# EAGLE board beaglebone_basic_v1.12 (EAGLE 5.11), part 1 of 3
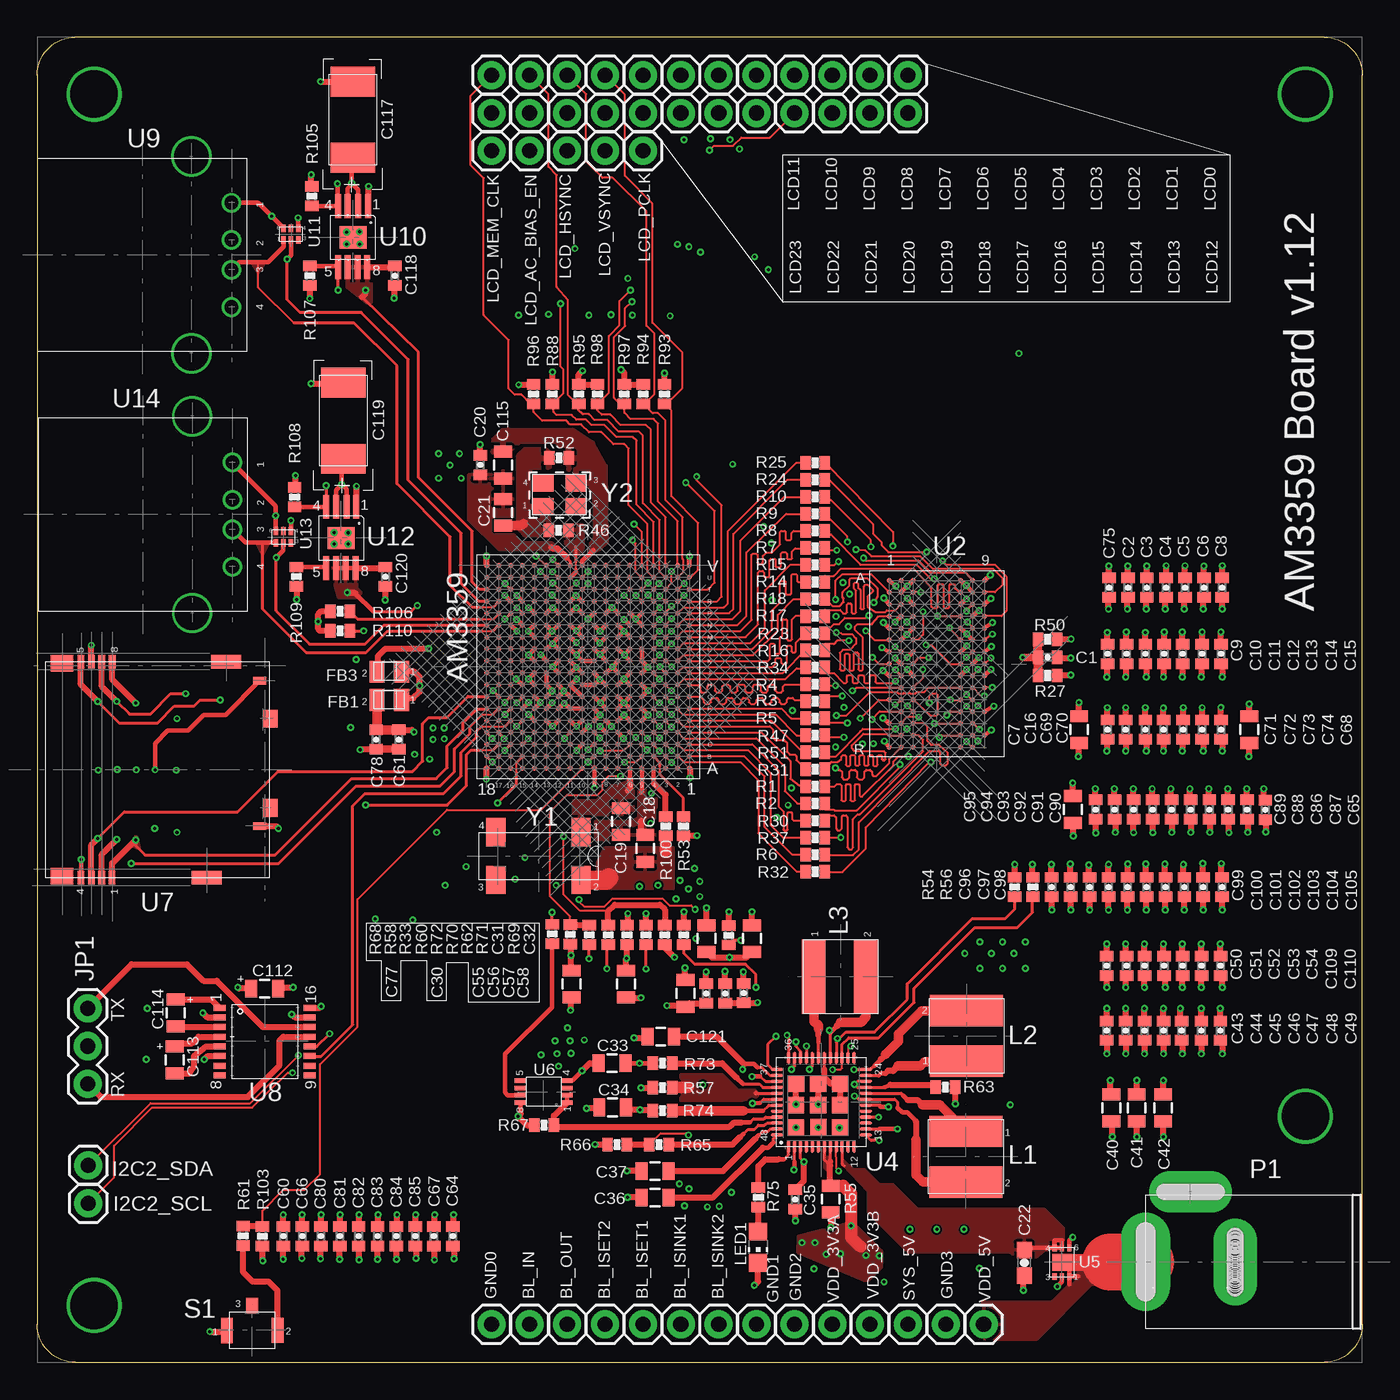
[diagram p7: board, top side]
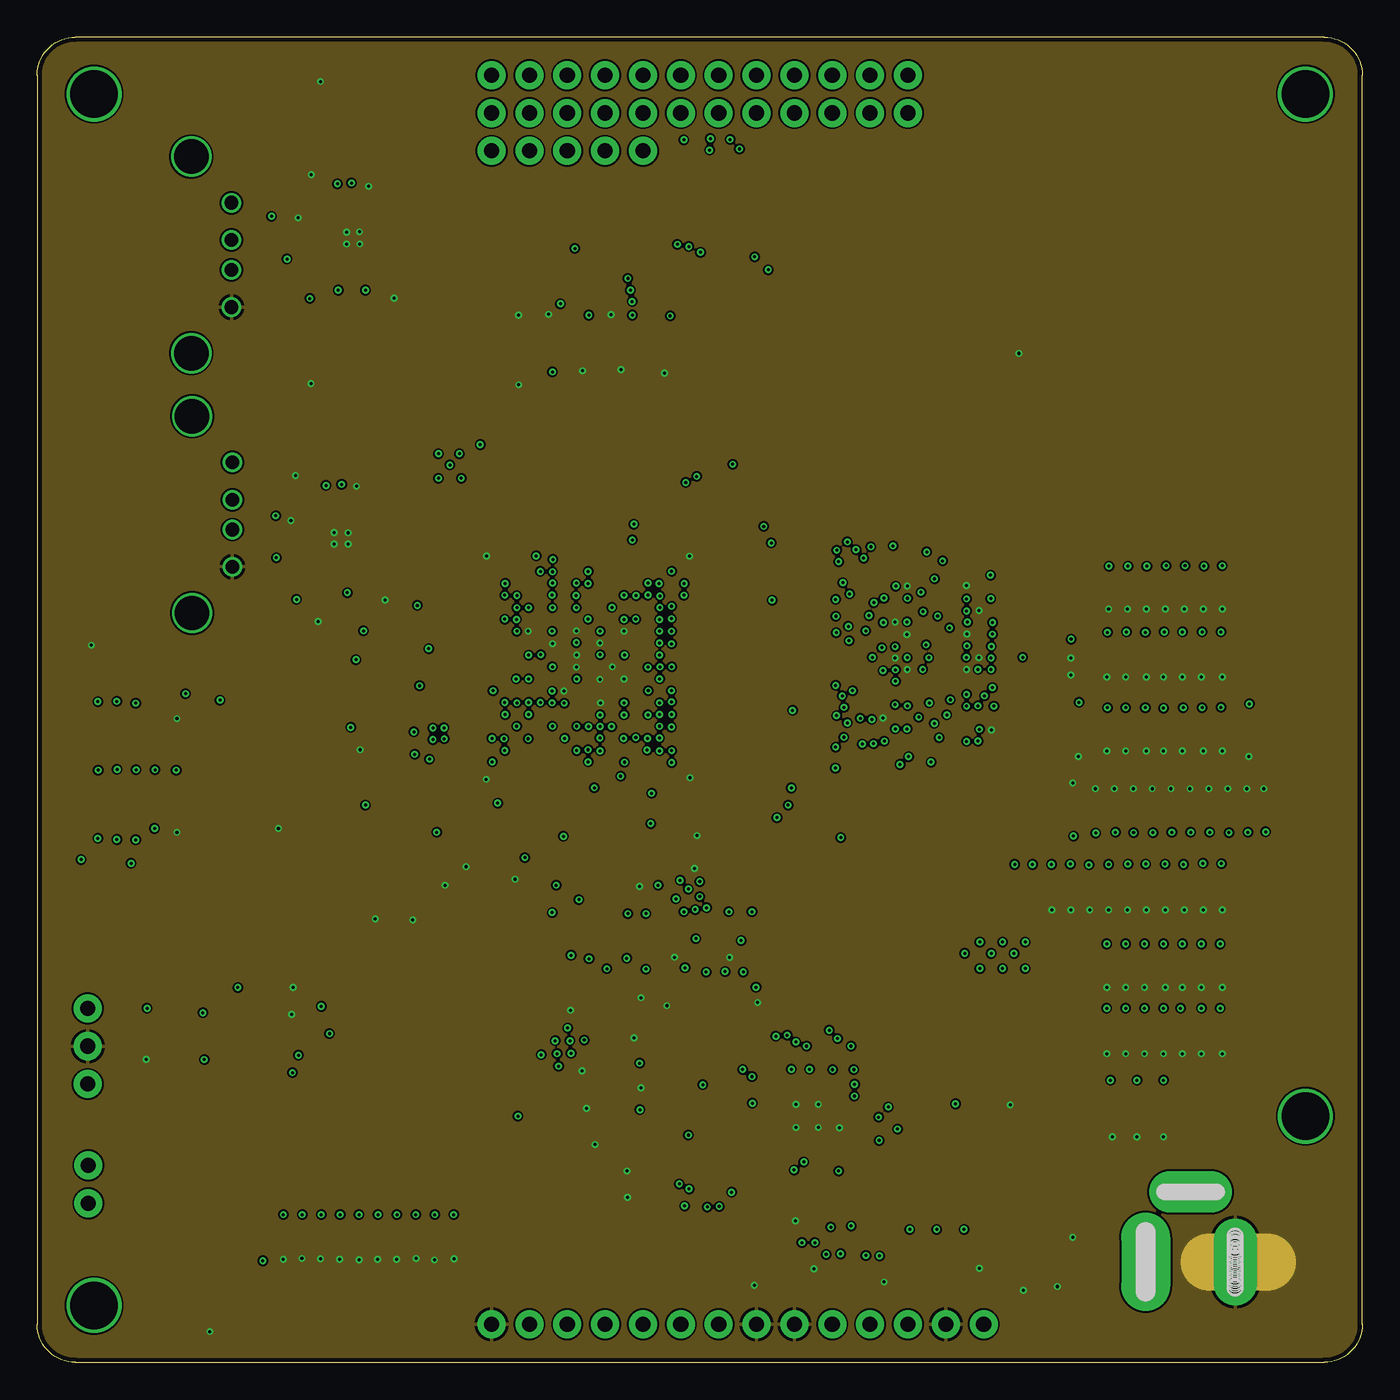
[diagram p8: board, inner layer Route2]
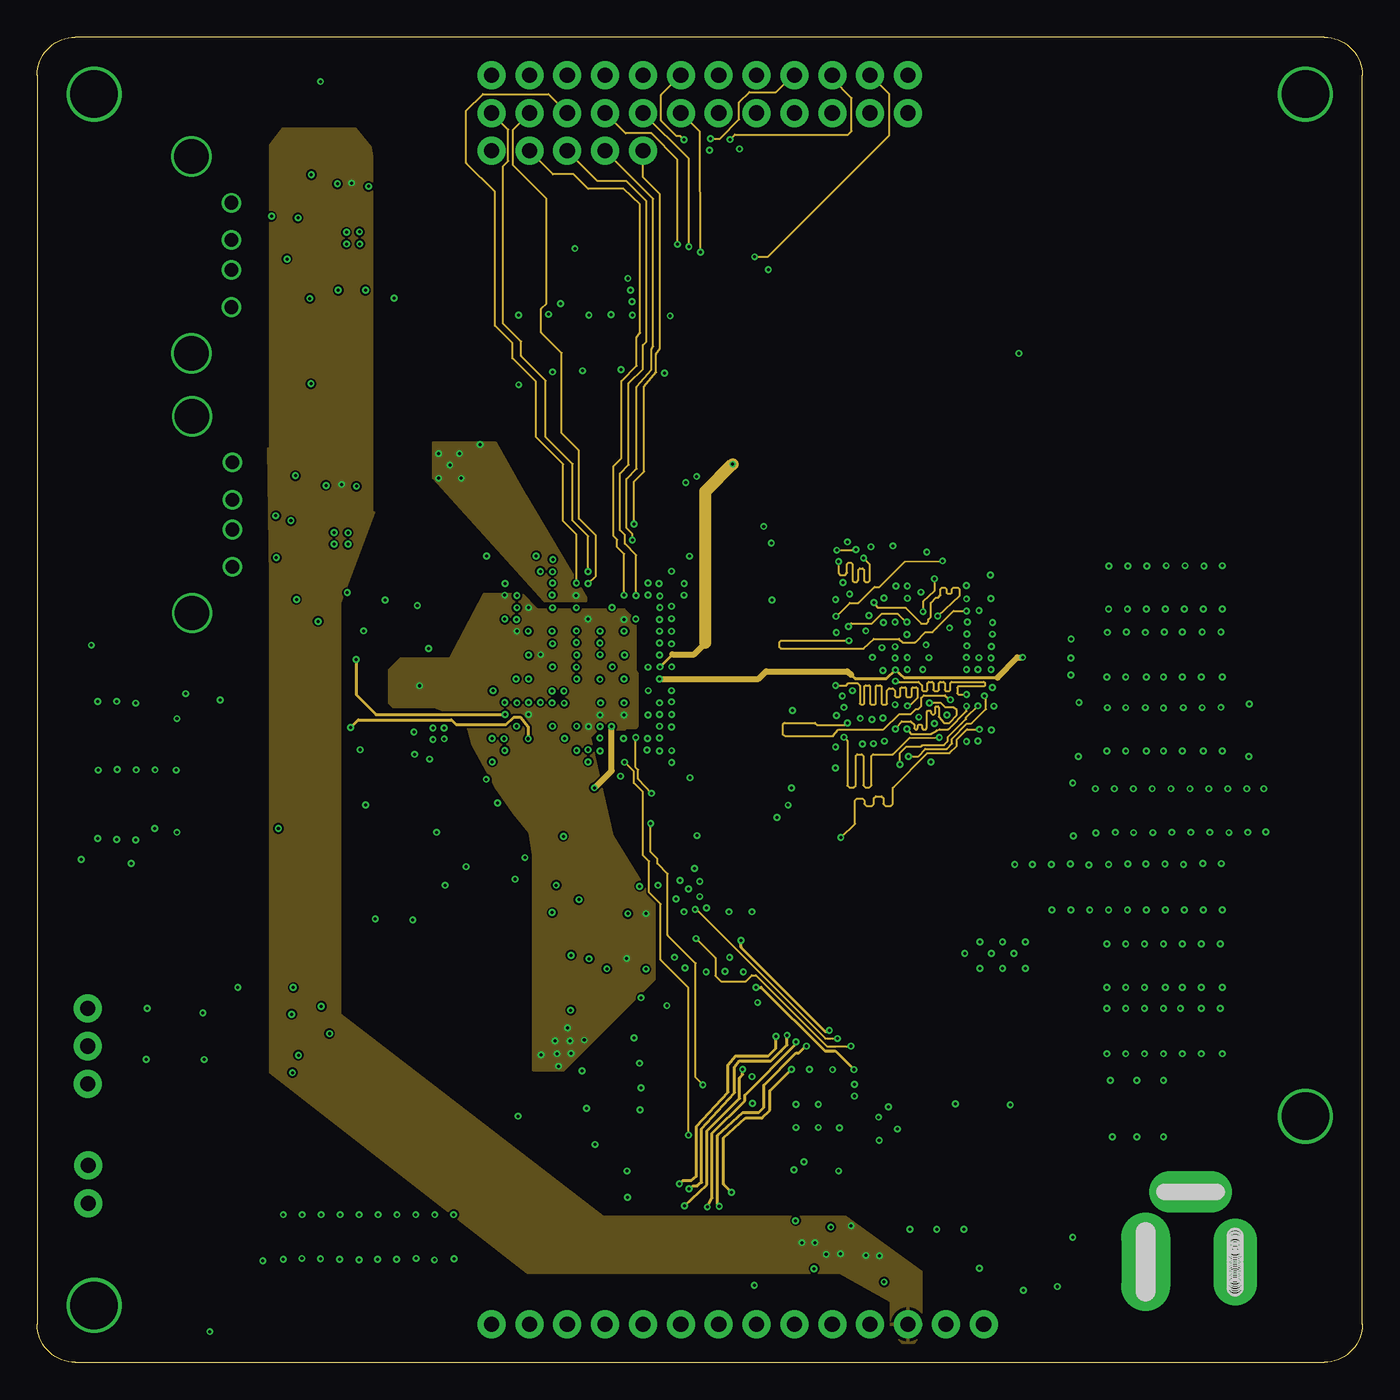
[diagram p9: board, inner layer Route3]
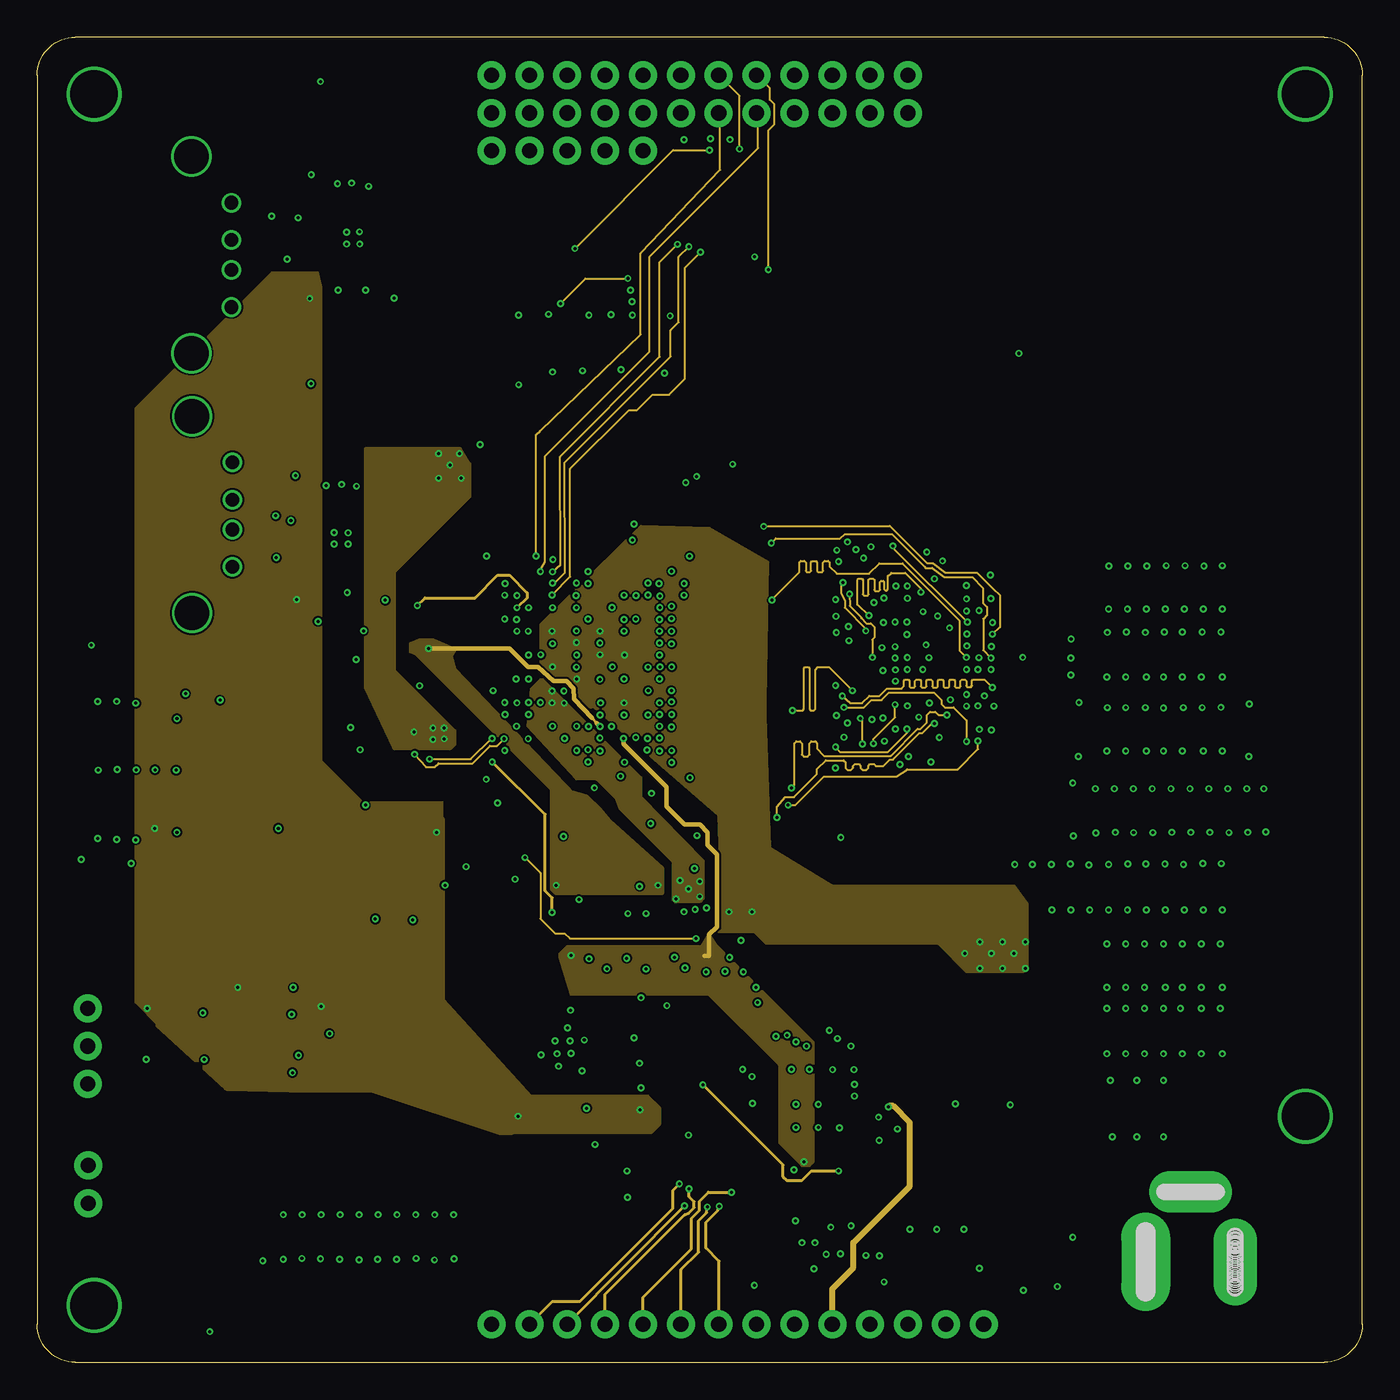
[diagram p10: board, inner layer Route14]
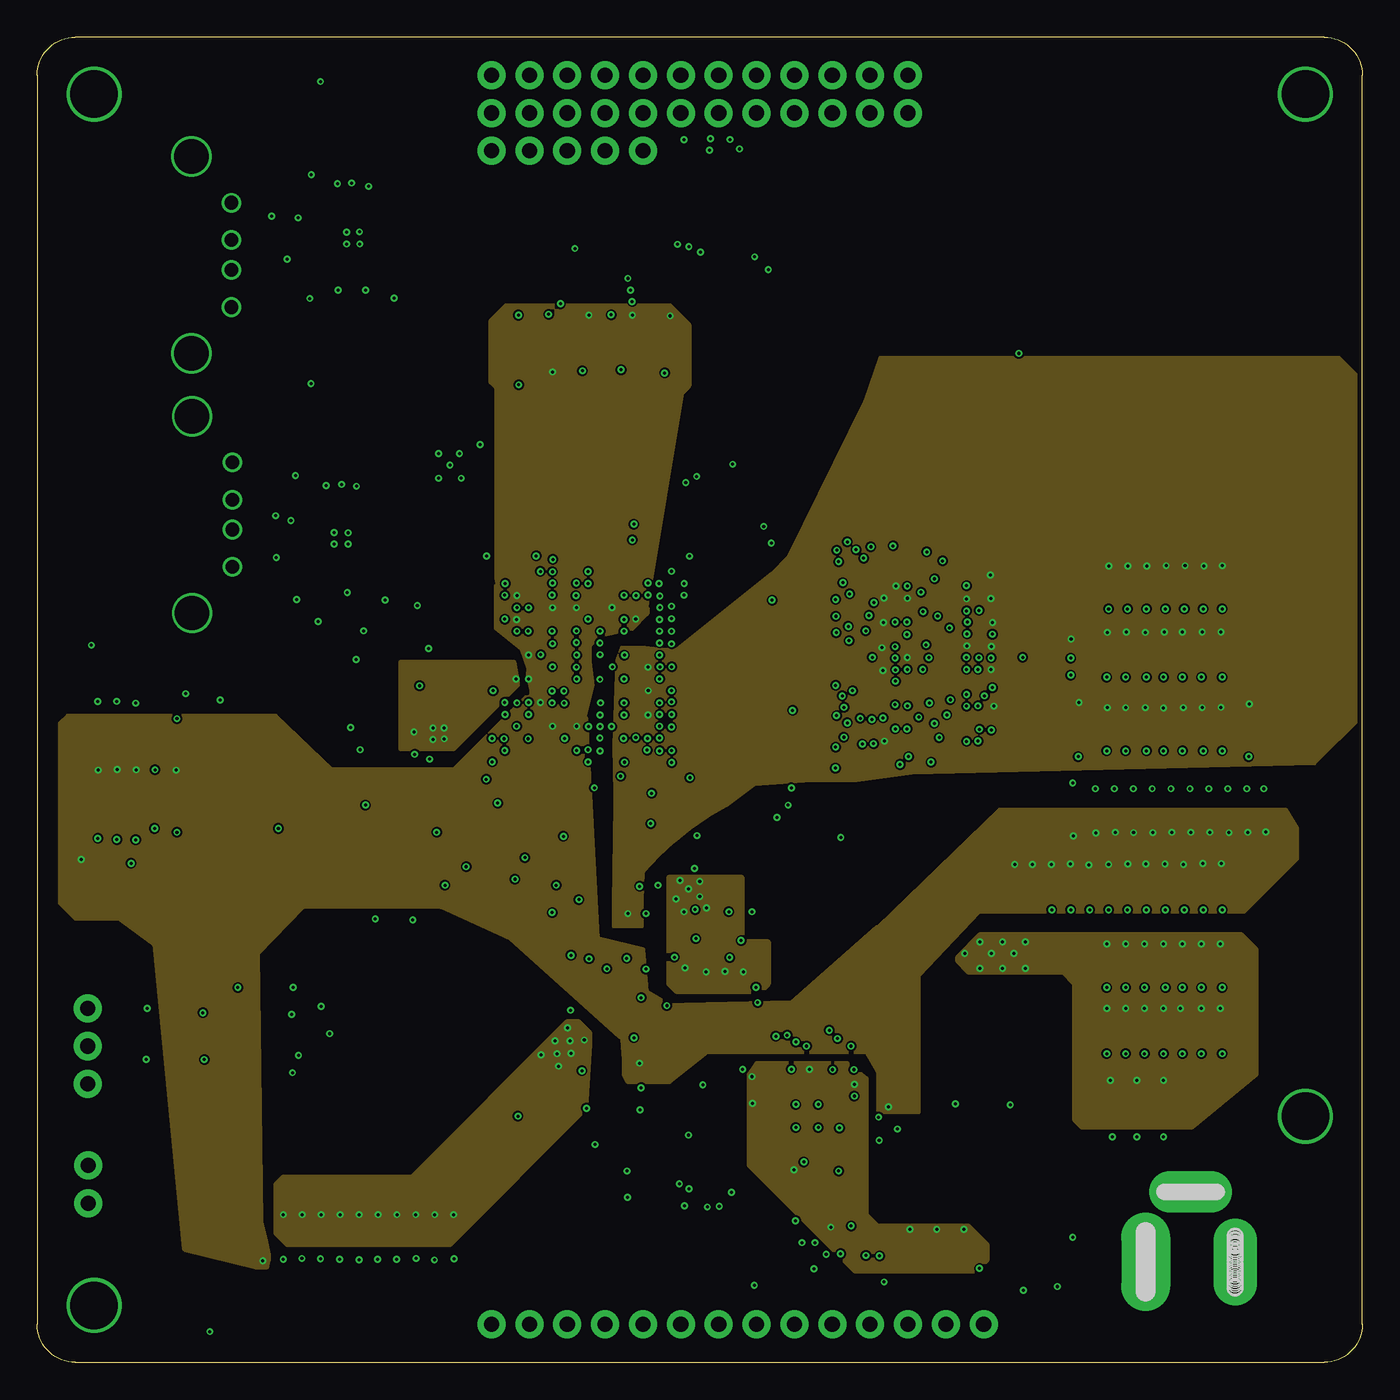
[diagram p11: board, inner layer Route15]
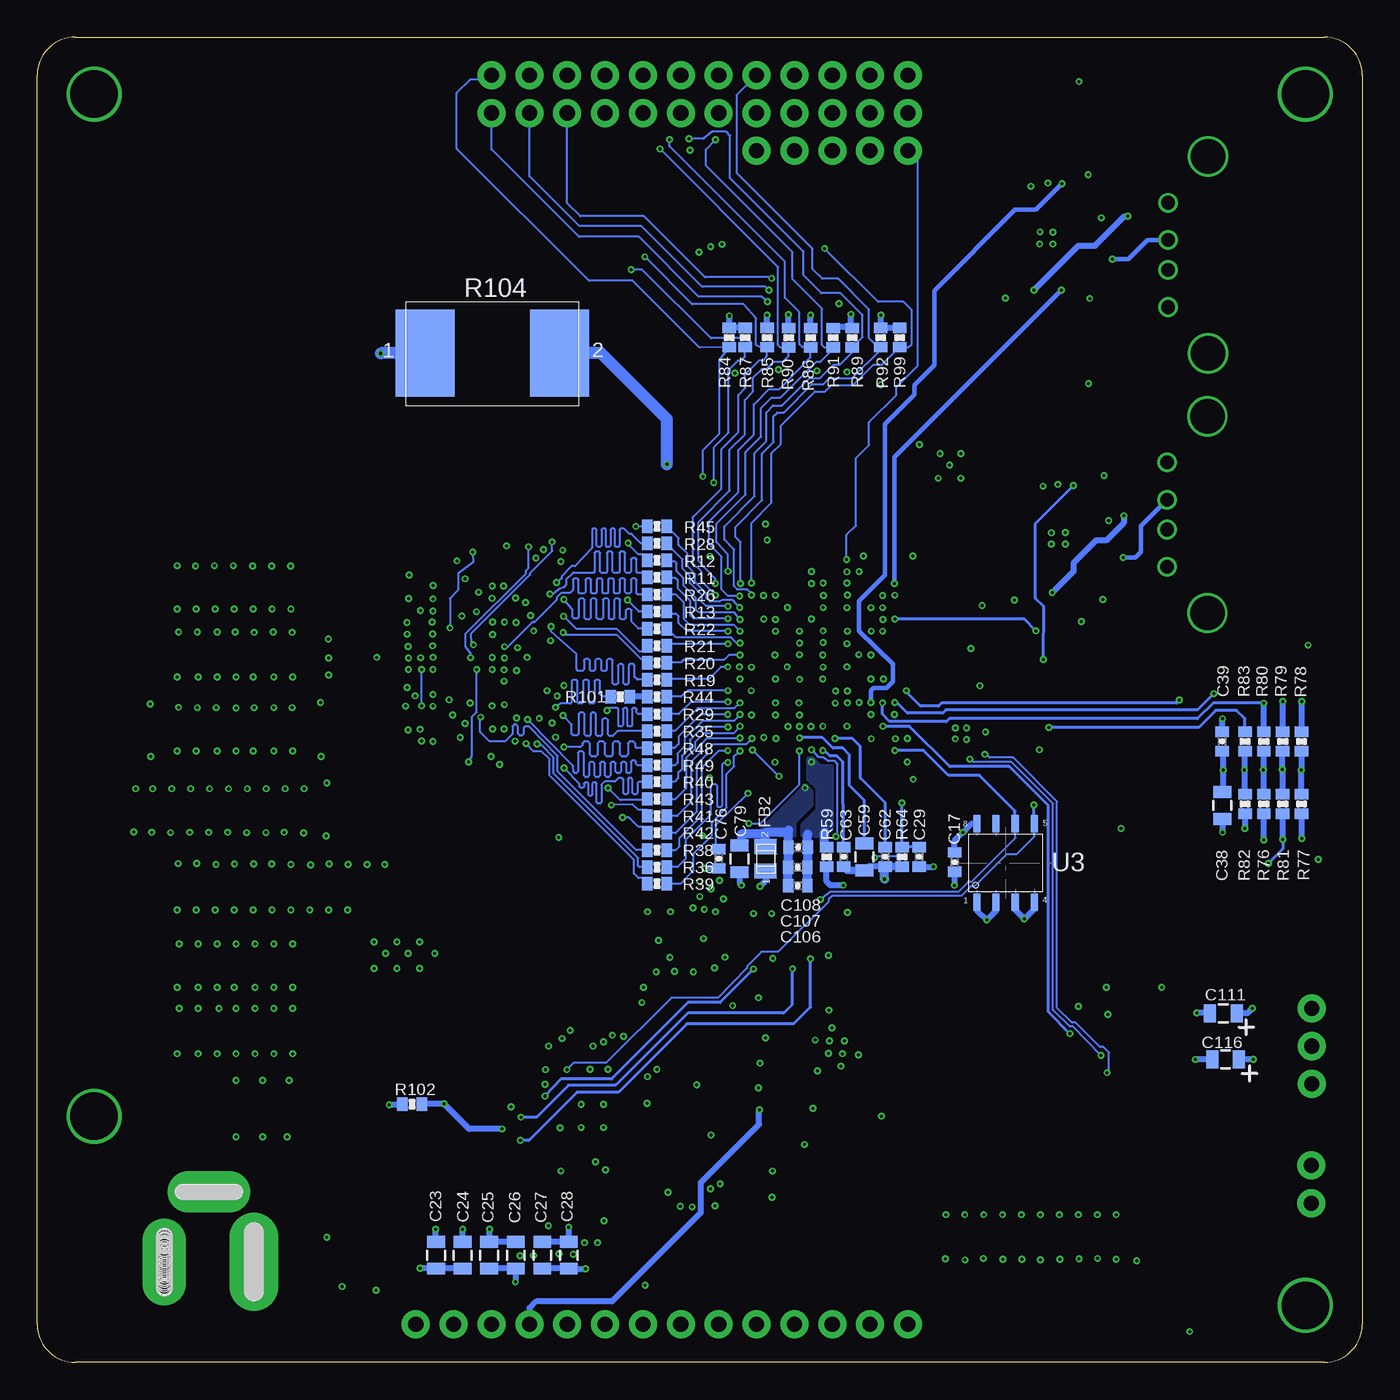
[diagram p12: board, bottom side, seen from below]

Size 88.9 x 88.9 mm. Coordinates in mm from the lower left corner, seen from the top.
Outline: 2.54,0 86.36,0 arc90 88.9,2.54 88.9,86.36 arc90 86.36,88.9 2.54,88.9 arc90 0,86.36 0,2.54 arc90 2.54,0
Copper layers (1*2*3+14*15*16): Top 0.035mm / dielectric 1.5mm / Route2 0.035mm / dielectric 0.15mm / Route3 0.035mm / dielectric 0.2mm / Route14 0.035mm / dielectric 0.15mm / Route15 0.035mm / dielectric 0.2mm / Bottom 0.035mm
Design rules "PCB-POOL HighSpec *": minimum track width 0.125mm, minimum drill 0.2mm, track to track 0.125mm, track to pad 0.125mm, pad to pad 0.125mm, via to via 0.125mm, smd to smd 0.125mm, copper to edge 0.3mm, drill to drill 0.2mm, minimum pad ring 0.2mm, minimum via ring 0.125mm, stop-mask expansion 0.075mm, vias tented up to drill 0mil, thermal gap 0.2mm
Net classes: 0 DATA: width 0.125 mm, drill 0.203 mm, clearance 0.125 mm; 1 GND: width 0.203 mm, drill 0.203 mm, clearance 0.125 mm to class 0, clearance 0.125 mm; 2 +5V: width 0.203 mm, drill 0.203 mm, clearance 0.125 mm to class 0, clearance 0.125 mm to class 1, clearance 0.125 mm; 3 +3.3V: width 0.203 mm, drill 0.203 mm, clearance 0.125 mm to class 0, clearance 0.125 mm to class 1, clearance 0.125 mm to class 2, clearance 0.125 mm; 4 +1.8V: width 0.203 mm, drill 0.203 mm, clearance 0.125 mm to class 0, clearance 0.125 mm to class 1, clearance 0.125 mm to class 2, clearance 0.125 mm to class 3, clearance 0.125 mm; 5 +1.1V: width 0.203 mm, drill 0.203 mm, clearance 0.125 mm to class 0, clearance 0.125 mm to class 1, clearance 0.125 mm to class 2, clearance 0.125 mm to class 3, clearance 0.125 mm to class 4, clearance 0.125 mm; 6 +1.3V: width 0.203 mm, drill 0.203 mm, clearance 0.125 mm to class 0, clearance 0.125 mm to class 1, clearance 0.125 mm to class 2, clearance 0.125 mm to class 3, clearance 0.125 mm to class 4, clearance 0.125 mm to class 5, clearance 0.125 mm

## Footprints (pad centres in the part's own frame; a part is rotated, then mirrored left to right if it is on the bottom)
ZCZ(S-PBGA-N324) = smd 0.33 x 0.33: A1 6.803,-6.804; A2 6.003,-6.804; A3 5.203,-6.804; A4 4.403,-6.804; A5 3.603,-6.804; A6 2.803,-6.804; A7 2.003,-6.804; A8 1.203,-6.804; A9 0.403,-6.804; A10 -0.397,-6.804; A11 -1.197,-6.804; A12 -1.997,-6.804; A13 -2.797,-6.804; A14 -3.597,-6.804; A15 -4.397,-6.804; A16 -5.197,-6.804; A17 -5.997,-6.804; A18 -6.797,-6.804; B1 6.803,-6.004; B2 6.003,-6.004; B3 5.203,-6.004; B4 4.403,-6.004; B5 3.603,-6.004; B6 2.803,-6.004; B7 2.003,-6.004; B8 1.203,-6.004; B9 0.403,-6.004; B10 -0.397,-6.004; B11 -1.197,-6.004; B12 -1.997,-6.004; B13 -2.797,-6.004; B14 -3.597,-6.004; B15 -4.397,-6.004; B16 -5.197,-6.004; B17 -5.997,-6.004; B18 -6.797,-6.004; C1 6.803,-5.204; C2 6.003,-5.204; C3 5.203,-5.204; C4 4.403,-5.204; C5 3.603,-5.204; C6 2.803,-5.204; C7 2.003,-5.204; C8 1.203,-5.204; C9 0.403,-5.204; C10 -0.397,-5.204; C11 -1.197,-5.204; C12 -1.997,-5.204; C13 -2.797,-5.204; C14 -3.597,-5.204; C15 -4.397,-5.204; C16 -5.197,-5.204; C17 -5.997,-5.204; C18 -6.797,-5.204; D1 6.803,-4.404; D2 6.003,-4.404; D3 5.203,-4.404; D4 4.403,-4.404; D5 3.603,-4.404; D6 2.803,-4.404; D7 2.003,-4.404; D8 1.203,-4.404; D9 0.403,-4.404; D10 -0.397,-4.404; D11 -1.197,-4.404; D12 -1.997,-4.404; D13 -2.797,-4.404; D14 -3.597,-4.404; D15 -4.397,-4.404; D16 -5.197,-4.404; D17 -5.997,-4.404; D18 -6.797,-4.404; E1 6.803,-3.604; E2 6.003,-3.604; E3 5.203,-3.604; E4 4.403,-3.604; E5 3.603,-3.604; E6 2.803,-3.604; E7 2.003,-3.604; E8 1.203,-3.604; E9 0.403,-3.604; E10 -0.397,-3.604; E11 -1.197,-3.604; E12 -1.997,-3.604; E13 -2.797,-3.604; E14 -3.597,-3.604; E15 -4.397,-3.604; E16 -5.197,-3.604; E17 -5.997,-3.604; E18 -6.797,-3.604; F1 6.803,-2.804; F2 6.003,-2.804; F3 5.203,-2.804; F4 4.403,-2.804; F5 3.603,-2.804; F6 2.803,-2.804; F7 2.003,-2.804; F8 1.203,-2.804; F9 0.403,-2.804; F10 -0.397,-2.804; F11 -1.197,-2.804; F12 -1.997,-2.804; F13 -2.797,-2.804; F14 -3.597,-2.804; F15 -4.397,-2.804; F16 -5.197,-2.804; F17 -5.997,-2.804; F18 -6.797,-2.804; G1 6.803,-2.004; G2 6.003,-2.004; G3 5.203,-2.004; G4 4.403,-2.004; G5 3.603,-2.004; G6 2.803,-2.004; G7 2.003,-2.004; G8 1.203,-2.004; G9 0.403,-2.004; G10 -0.397,-2.004; G11 -1.197,-2.004; G12 -1.997,-2.004; G13 -2.797,-2.004; G14 -3.597,-2.004; G15 -4.397,-2.004; G16 -5.197,-2.004; G17 -5.997,-2.004; G18 -6.797,-2.004; H1 6.803,-1.204; H2 6.003,-1.204; H3 5.203,-1.204; H4 4.403,-1.204; H5 3.603,-1.204; H6 2.803,-1.204; H7 2.003,-1.204; H8 1.203,-1.204; H9 0.403,-1.204; H10 -0.397,-1.204; H11 -1.197,-1.204; H12 -1.997,-1.204; H13 -2.797,-1.204; H14 -3.597,-1.204; H15 -4.397,-1.204; H16 -5.197,-1.204; H17 -5.997,-1.204; H18 -6.797,-1.204; J1 6.803,-0.404; J2 6.003,-0.404; J3 5.203,-0.404; J4 4.403,-0.404; J5 3.603,-0.404; J6 2.803,-0.404; J7 2.003,-0.404; J8 1.203,-0.404; J9 0.403,-0.404; J10 -0.397,-0.404; J11 -1.197,-0.404; J12 -1.997,-0.404; J13 -2.797,-0.404; J14 -3.597,-0.404; J15 -4.397,-0.404; J16 -5.197,-0.404; J17 -5.997,-0.404; J18 -6.797,-0.404; K1 6.803,0.396; K2 6.003,0.396; K3 5.203,0.396; K4 4.403,0.396; K5 3.603,0.396; K6 2.803,0.396; K7 2.003,0.396; K8 1.203,0.396; K9 0.403,0.396; K10 -0.397,0.396; K11 -1.197,0.396; K12 -1.997,0.396; K13 -2.797,0.396; K14 -3.597,0.396; K15 -4.397,0.396; K16 -5.197,0.396; K17 -5.997,0.396; K18 -6.797,0.396; L1 6.803,1.196; L2 6.003,1.196; L3 5.203,1.196; L4 4.403,1.196; L5 3.603,1.196; L6 2.803,1.196; L7 2.003,1.196; L8 1.203,1.196; L9 0.403,1.196; L10 -0.397,1.196; L11 -1.197,1.196; L12 -1.997,1.196; L13 -2.797,1.196; L14 -3.597,1.196; L15 -4.397,1.196; L16 -5.197,1.196; L17 -5.997,1.196; L18 -6.797,1.196; M1 6.803,1.996; M2 6.003,1.996; M3 5.203,1.996; M4 4.403,1.996; M5 3.603,1.996; M6 2.803,1.996; M7 2.003,1.996; M8 1.203,1.996; M9 0.403,1.996; M10 -0.397,1.996; M11 -1.197,1.996; M12 -1.997,1.996; M13 -2.797,1.996; M14 -3.597,1.996; M15 -4.397,1.996; M16 -5.197,1.996; M17 -5.997,1.996; M18 -6.797,1.996; N1 6.803,2.796; N2 6.003,2.796; N3 5.203,2.796; N4 4.403,2.796; N5 3.603,2.796; N6 2.803,2.796; N7 2.003,2.796; N8 1.203,2.796; N9 0.403,2.796; N10 -0.397,2.796; N11 -1.197,2.796; N12 -1.997,2.796; N13 -2.797,2.796; N14 -3.597,2.796; N15 -4.397,2.796; N16 -5.197,2.796; N17 -5.997,2.796; N18 -6.797,2.796; P1 6.803,3.596; P2 6.003,3.596; P3 5.203,3.596; P4 4.403,3.596; P5 3.603,3.596; P6 2.803,3.596; P7 2.003,3.596; P8 1.203,3.596; P9 0.403,3.596; P10 -0.397,3.596; P11 -1.197,3.596; P12 -1.997,3.596; P13 -2.797,3.596; P14 -3.597,3.596; P15 -4.397,3.596; P16 -5.197,3.596; P17 -5.997,3.596; P18 -6.797,3.596; R1 6.803,4.396; R2 6.003,4.396; R3 5.203,4.396; R4 4.403,4.396; R5 3.603,4.396; R6 2.803,4.396; R7 2.003,4.396; R8 1.203,4.396; R9 0.403,4.396; R10 -0.397,4.396; R11 -1.197,4.396; R12 -1.997,4.396; R13 -2.797,4.396; R14 -3.597,4.396; R15 -4.397,4.396; R16 -5.197,4.396; R17 -5.997,4.396; R18 -6.797,4.396; T1 6.803,5.196; T2 6.003,5.196; T3 5.203,5.196; T4 4.403,5.196; T5 3.603,5.196; T6 2.803,5.196; T7 2.003,5.196; T8 1.203,5.196; T9 0.403,5.196; T10 -0.397,5.196; T11 -1.197,5.196; T12 -1.997,5.196; T13 -2.797,5.196; T14 -3.597,5.196; T15 -4.397,5.196; T16 -5.197,5.196; T17 -5.997,5.196; T18 -6.797,5.196; U1 6.803,5.996; U2 6.003,5.996; U3 5.203,5.996; U4 4.403,5.996; U5 3.603,5.996; U6 2.803,5.996; U7 2.003,5.996; U8 1.203,5.996; U9 0.403,5.996; U10 -0.397,5.996; U11 -1.197,5.996; U12 -1.997,5.996; U13 -2.797,5.996; U14 -3.597,5.996; U15 -4.397,5.996; U16 -5.197,5.996; U17 -5.997,5.996; U18 -6.797,5.996; V1 6.803,6.796; V2 6.003,6.796; V3 5.203,6.796; V4 4.403,6.796; V5 3.603,6.796; V6 2.803,6.796; V7 2.003,6.796; V8 1.203,6.796; V9 0.403,6.796; V10 -0.397,6.796; V11 -1.197,6.796; V12 -1.997,6.796; V13 -2.797,6.796; V14 -3.597,6.796; V15 -4.397,6.796; V16 -5.197,6.796; V17 -5.997,6.796; V18 -6.797,6.796
1X01 = drill 1.016 pad 1.88 round: 1 0,0
0402-CAP = smd 0.7 x 0.9: 1 -0.65,0; 2 0.65,0
0805 = smd 0.8 x 1.2: 1 -0.9,0; 2 0.9,0
0603-CAP = smd 1.1 x 1: 1 -0.85,0; 2 0.85,0
B45196H1107M309_PACKAGE = smd 2 x 3: 1 -2.5,-0.1; 2 2.6,-0.1
LI0805H151R-10_PACKAGE = smd 1 x 1.47: 1 -0.822,0.025; 2 0.828,0.025
1X03 = drill 1.016 pad 1.88 round: 1 0,0; 2 2.54,0; 3 5.08,0
VLCF5020T-2R2N2R6-3 = smd 4.9 x 2.1: 1 -0.012,-1.698; 2 -0.002,1.702
ELL-5PR2R2N = smd 5 x 1.6: 1 -0.002,-1.798; 2 -0.002,1.702
CHIP-LED0805 = smd 1.2 x 1.2: A 0,-1.05; C 0,1.05
PJ-002A_PACKAGE = drill 1.2 pad 3.302 long: 1 6.907,-0.004 | drill 1 pad 2.921 long: 2 0.907,-0.004 | drill 1 pad 2.794 long: 3 3.907,-4.714 | hole 1: 0.907,-0.154; 0.907,-0.304; 0.907,-0.454; 0.907,-0.604; 0.907,-0.754; 0.907,-0.904; 0.907,-1.054; 0.907,-1.154; 0.907,-1.254; 0.907,-1.404; 0.907,-1.504; 0.907,-1.654; 0.907,-1.754; 0.907,0.146; 0.907,0.296; 0.907,0.446; 0.907,0.596; 0.907,0.746; 0.907,0.896; 0.907,1.046; 0.907,1.196; 0.907,1.346; 0.907,1.496; 0.907,1.646; 0.907,1.746; 4.007,-4.704; 4.107,-4.704; 4.207,-4.704; 4.307,-4.704; 4.407,-4.704; 4.507,-4.704; 4.607,-4.704; 4.707,-4.704; 4.807,-4.704; 4.907,-4.704; 5.007,-4.704; 5.107,-4.704; 5.207,-4.704; 5.307,-4.704; 5.407,-4.704; 5.507,-4.704; 5.607,-4.704; 5.657,-4.704; 3.807,-4.704; 3.707,-4.704; 3.607,-4.704; 3.507,-4.704; 3.407,-4.704; 3.307,-4.704; 3.207,-4.704; 3.107,-4.704; 3.007,-4.704; 2.907,-4.704; 2.807,-4.704; 2.707,-4.704; 2.607,-4.704; 2.507,-4.704; 2.407,-4.704; 2.307,-4.704; 2.207,-4.704; 2.157,-4.704 | hole 1.2: 6.907,-0.104; 6.907,-0.204; 6.907,-0.304; 6.907,-0.404; 6.907,-2.004; 6.907,1.996; 6.907,1.896; 6.907,1.796; 6.907,1.696; 6.907,1.596; 6.907,1.496; 6.907,1.396; 6.907,1.296; 6.907,1.196; 6.907,1.096; 6.907,0.996; 6.907,0.896; 6.907,0.796; 6.907,0.696; 6.907,0.596; 6.907,0.496; 6.907,0.396; 6.907,0.296; 6.907,0.196; 6.907,0.096; 6.907,-0.504; 6.907,-0.604; 6.907,-0.704; 6.907,-0.804; 6.907,-0.904; 6.907,-1.004; 6.907,-1.104; 6.907,-1.204; 6.907,-1.304; 6.907,-1.404; 6.907,-1.504; 6.907,-1.604; 6.907,-1.704; 6.907,-1.804; 6.907,-1.904
0402-RES = smd 0.7 x 0.9: 1 -0.65,0; 2 0.65,0
WSC452750R00FEA_PACKAGE = smd 3.937 x 5.842: 1 -4.508,-0.025; 2 4.508,-0.025
B3U-1100P_PACKAGE = smd 0.8 x 1.7: 1 1.701,0.005; 2 -1.699,-0.015 | smd 0.8 x 1.1: 3 0.001,-1.655
FBGA_84_BALL_RAM = smd 0.33 x 0.33: A1 -3.196,5.598; A2 -2.396,5.598; A3 -1.596,5.598; A7 1.604,5.598; A8 2.404,5.598; A9 3.204,5.598; B1 -3.196,4.798; B2 -2.396,4.798; B3 -1.596,4.798; B7 1.604,4.798; B8 2.404,4.798; B9 3.204,4.798; C1 -3.196,3.998; C2 -2.396,3.998; C3 -1.596,3.998; C7 1.604,3.998; C8 2.404,3.998; C9 3.204,3.998; D1 -3.196,3.198; D2 -2.396,3.198; D3 -1.596,3.198; D7 1.604,3.198; D8 2.404,3.198; D9 3.204,3.198; E1 -3.196,2.398; E2 -2.396,2.398; E3 -1.596,2.398; E7 1.604,2.398; E8 2.404,2.398; E9 3.204,2.398; F1 -3.196,1.598; F2 -2.396,1.598; F3 -1.596,1.598; F7 1.604,1.598; F8 2.404,1.598; F9 3.204,1.598; G1 -3.196,0.798; G2 -2.396,0.798; G3 -1.596,0.798; G7 1.604,0.798; G8 2.404,0.798; G9 3.204,0.798; H1 -3.196,-0.002; H2 -2.396,-0.002; H3 -1.596,-0.002; H7 1.604,-0.002; H8 2.404,-0.002; H9 3.204,-0.002; J1 -3.196,-0.802; J2 -2.396,-0.802; J3 -1.596,-0.802; J7 1.604,-0.802; J8 2.404,-0.802; J9 3.204,-0.802; K2 -2.396,-1.602; K3 -1.596,-1.602; K7 1.604,-1.602; K8 2.404,-1.602; K9 3.204,-1.602; L1 -3.196,-2.402; L2 -2.396,-2.402; L3 -1.596,-2.402; L7 1.604,-2.402; L8 2.404,-2.402; M2 -2.396,-3.202; M3 -1.596,-3.202; M7 1.604,-3.202; M8 2.404,-3.202; M9 3.204,-3.202; N1 -3.196,-4.002; N2 -2.396,-4.002; N3 -1.596,-4.002; N7 1.604,-4.002; N8 2.404,-4.002; P2 -2.396,-4.802; P3 -1.596,-4.802; P7 1.604,-4.802; P8 2.404,-4.802; P9 3.204,-4.802; R1 -3.196,-5.602; R2 -2.396,-5.602; R3 -1.596,-5.602; R7 1.604,-5.602; R8 2.404,-5.602
SOIC8_CASE_751BD-01 = smd 0.5 x 1.2: 1 -1.921,-2.624; 2 -0.641,-2.624; 3 0.639,-2.624; 4 1.919,-2.624; 5 1.919,2.636; 6 0.639,2.636; 7 -0.641,2.636; 8 -1.921,2.636
RSL(S-PVQFN-N8) = smd 0.2 x 0.85: 1 -2.197,-2.975; 2 -1.797,-2.975; 3 -1.397,-2.975; 4 -0.997,-2.975; 5 -0.597,-2.975; 6 -0.197,-2.975; 7 0.203,-2.975; 8 0.603,-2.975; 9 1.003,-2.975; 10 1.403,-2.975; 11 1.803,-2.975; 12 2.203,-2.975; 25 2.203,2.976; 26 1.803,2.976; 27 1.403,2.976; 28 1.003,2.976; 29 0.603,2.976; 30 0.203,2.976; 31 -0.197,2.976; 32 -0.597,2.976; 33 -0.997,2.976; 34 -1.397,2.976; 35 -1.797,2.976; 36 -2.197,2.976 | smd 0.85 x 0.2: 13 2.981,-2.202; 14 2.981,-1.802; 15 2.981,-1.402; 16 2.981,-1.002; 17 2.981,-0.602; 18 2.981,-0.202; 19 2.981,0.198; 20 2.981,0.598; 21 2.981,0.998; 22 2.981,1.398; 23 2.981,1.798; 24 2.981,2.198; 37 -2.97,2.198; 38 -2.97,1.798; 39 -2.97,1.398; 40 -2.97,0.998; 41 -2.97,0.598; 42 -2.97,0.198; 43 -2.97,-0.202; 44 -2.97,-0.602; 45 -2.97,-1.002; 46 -2.97,-1.402; 47 -2.97,-1.802; 48 -2.97,-2.202 | smd 1.1 x 1.1: PAD -1.697,-1.692; PAD1 -1.697,-0.202; PAD2 -1.687,1.248; PAD3 -0.187,-1.672; PAD4 -0.197,-0.192; PAD5 -0.197,1.248; PAD6 1.253,-1.702; PAD7 1.263,-0.192; PAD8 1.268,1.248
DFN6 = smd 0.335 x 0.43: 1 -0.5,0.953; 2 0,0.953; 3 0.5,0.953; 4 0.5,-0.947; 5 0,-0.947; 6 -0.5,-0.947 | smd 1.3 x 1.15: PAD 0,0
DCU_8 = smd 0.3 x 0.8: 1 -0.753,-1.544; 2 -0.253,-1.544; 3 0.247,-1.544; 4 0.747,-1.544; 5 0.747,1.556; 6 0.247,1.556; 7 -0.253,1.556; 8 -0.753,1.556
SCHA5B0200_PACKAGE = smd 0.9 x 0.45: 1 7.248,-3.209; 2 7.248,-3.899; 3 7.248,-4.599; 4 7.248,-5.299; 5 -7.252,-5.299; 6 -7.252,-4.599; 7 -7.252,-3.899; 8 -7.252,-3.199 | smd 0.5 x 0.9: 9 3.773,6.691; 10 -5.977,6.691 | smd 1.1 x 1.5: 11 -7.152,-6.559; 12 7.148,-6.559 | smd 0.9 x 2: 13 -7.252,4.441; 14 7.248,3.141 | smd 1.2 x 1: 15 -3.427,7.391; 16 2.573,7.391
ADM3202ARUZ_PACKAGE_TSSOP = smd 0.4 x 0.8: 1 -2.277,-3.028; 2 -1.627,-3.028; 3 -0.977,-3.028; 4 -0.327,-3.028; 5 0.323,-3.028; 6 0.973,-3.028; 7 1.623,-3.028; 8 2.273,-3.028; 9 2.273,3.022; 10 1.623,3.022; 11 0.973,3.022; 12 0.323,3.022; 13 -0.327,3.022; 14 -0.977,3.022; 15 -1.627,3.022; 16 -2.277,3.022
USB_87520_0010BLF_USB_HOST_PACKAGE = drill 0.92 round: 1 -3.5,6; 2 -1,6; 3 1,6; 4 3.5,6 | drill 2.3 round: 5 -6.6,3.3; 6 6.6,3.3
DGN8 = smd 0.4 x 1.6: 1 -1,-2.1; 2 -0.35,-2.1; 3 0.35,-2.1; 4 1,-2.1; 5 1,2; 6 0.35,2; 7 -0.3,2; 8 -0.95,2 | smd 1.8 x 1.5: P$1 0,0
DRY6 = smd 0.3 x 0.52: 1 -0.5,-0.39; 2 0,-0.39; 3 0.5,-0.39; 4 0.5,0.39; 5 0,0.39; 6 -0.5,0.39
MC-306_PACKAGE = smd 1.3 x 1.9: 1 2.857,1.599; 2 2.854,-1.605; 3 -2.85,-1.601; 4 -2.85,1.599
CS325_PACKAGE = smd 1.4 x 1.15: 1 -1.116,-0.786; 2 1.084,-0.786; 3 1.084,0.814; 4 -1.116,0.814

## Placement (x,y rotation side)
AM3359  AM335X  [ZCZ(S-PBGA-N324)]  36.96,46.66 0 top
BL_IN  M01PTH  [1X01]  33.02,2.54 90 top
BL_ISET1  M01PTH  [1X01]  40.64,2.54 90 top
BL_ISET2  M01PTH  [1X01]  38.1,2.54 90 top
BL_ISINK1  M01PTH  [1X01]  43.18,2.54 90 top
BL_ISINK2  M01PTH  [1X01]  45.72,2.54 90 top
BL_OUT  M01PTH  [1X01]  35.56,2.54 90 top
C1  0.01uF, 16V  [0402-CAP]  67.79,47.29 0 top
C2  0.01uF, 16V  [0402-CAP]  73.18,51.97 270 top
C3  0.01uF, 16V  [0402-CAP]  74.45,51.97 270 top
C4  0.01uF, 16V  [0402-CAP]  75.74,51.97 270 top
C5  0.01uF, 16V  [0402-CAP]  77.01,51.97 270 top
C6  0.01uF, 16V  [0402-CAP]  78.28,51.97 270 top
C7  22uF, 6.3V  [0805]  69.9,42.44 270 top
C8  0.01uF, 16V  [0402-CAP]  79.5,51.97 270 top
C9  0.01uF, 16V  [0402-CAP]  71.81,47.52 270 top
C10  0.01uF, 16V  [0402-CAP]  73.08,47.52 270 top
C11  0.01uF, 16V  [0402-CAP]  74.35,47.52 270 top
C12  0.01uF, 16V  [0402-CAP]  75.62,47.52 270 top
C13  0.01uF, 16V  [0402-CAP]  76.83,47.52 270 top
C14  0.01uF, 16V  [0402-CAP]  78.16,47.52 270 top
C15  0.01uF, 16V  [0402-CAP]  79.43,47.52 270 top
C16  0.01uF, 16V  [0402-CAP]  71.81,42.44 270 top
C17  0.1uF, 16V  [0402-CAP]  27.36,33.55 90 bottom
C18  25pF, 50V  [0805]  40.79,34.47 90 top
C19  25pF, 50V  [0805]  39.17,36.27 90 top
C20  0.01uF, 16V  [0402-CAP]  29.72,60.2 270 top
C21  18pF, 50V  [0805]  31.24,57.02 90 top
C22  4.7uF, 6.3V  [0603-CAP]  66.22,6.68 270 top
C23  10uF, 10V  [0805]  62.13,7.19 270 bottom
C24  10uF, 10V  [0805]  60.35,7.19 270 bottom
C25  10uF, 10V  [0805]  58.57,7.19 270 bottom
C26  10uF, 10V  [0805]  56.79,7.19 270 bottom
C27  10uF, 10V  [0805]  55.02,7.19 270 bottom
C28  10uF, 10V  [0805]  53.24,7.19 270 bottom
C29  0.01uF, 16V  [0402-CAP]  29.72,33.91 270 bottom
C30  22uF, 6.3V  [0805]  39.5,25.37 270 top
C31  10uF, 10V  [0805]  44.91,28.42 270 top
C32  10uF, 10V  [0805]  47.96,28.42 270 top
C33  10uF, 10V  [0805]  38.56,20.07 180 top
C34  10uF, 10V  [0805]  38.61,17.09 180 top
C35  2.2uF, 6.3V  [0402-CAP]  50.85,10.92 270 top
C36  10uF, 10V  [0805]  41.45,11.05 180 top
C37  10uF, 10V  [0805]  41.45,12.83 180 top
C38  10uF, 10V  [0805]  9.4,37.36 270 bottom
C39  0.1uF, 16V  [0402-CAP]  9.4,41.66 90 bottom
C40  10uF, 10V  [0805]  72.06,17.07 270 top
C41  10uF, 10V  [0805]  73.76,17.07 270 top
C42  10uF, 10V  [0805]  75.54,17.07 270 top
C43  0.01uF, 16V  [0402-CAP]  71.75,22.25 270 top
C44  0.01uF, 16V  [0402-CAP]  73.03,22.25 270 top
C45  0.01uF, 16V  [0402-CAP]  74.3,22.25 270 top
C46  0.01uF, 16V  [0402-CAP]  75.56,22.25 270 top
C47  0.01uF, 16V  [0402-CAP]  76.78,22.25 270 top
C48  0.01uF, 16V  [0402-CAP]  78.11,22.25 270 top
C49  0.01uF, 16V  [0402-CAP]  79.38,22.25 270 top
C50  0.01uF, 16V  [0402-CAP]  71.75,26.59 270 top
C51  0.01uF, 16V  [0402-CAP]  73.08,26.59 270 top
C52  0.01uF, 16V  [0402-CAP]  74.3,26.59 270 top
C53  0.01uF, 16V  [0402-CAP]  75.62,26.59 270 top
C54  0.01uF, 16V  [0402-CAP]  76.83,26.59 270 top
C55  10uF, 10V  [0805]  43.48,24.74 270 top
C56  0.01uF, 16V  [0402-CAP]  44.88,24.74 270 top
C57  0.01uF, 16V  [0402-CAP]  46.15,24.74 270 top
C58  0.01uF, 16V  [0402-CAP]  47.4,24.77 270 top
C59  1uF, 10V  [0805]  33.4,33.91 270 bottom
C60  0.01uF, 16V  [0402-CAP]  16.51,8.46 270 top
C61  0.01uF, 16V  [0402-CAP]  24.26,41.78 270 top
C62  1uF, 10V  [0402-CAP]  32,33.91 270 bottom
C63  1uF, 10V  [0402-CAP]  34.8,33.91 270 bottom
C64  0.01uF, 16V  [0402-CAP]  27.89,8.46 270 top
C65  0.01uF, 16V  [0402-CAP]  82.4,37.06 90 top
C66  0.01uF, 16V  [0402-CAP]  17.78,8.46 270 top
C67  0.01uF, 16V  [0402-CAP]  26.62,8.46 270 top
C68  10uF, 10V  [0805]  81.33,42.44 270 top
C69  0.01uF, 16V  [0402-CAP]  73.03,42.44 270 top
C70  0.01uF, 16V  [0402-CAP]  74.35,42.44 270 top
C71  0.01uF, 16V  [0402-CAP]  75.56,42.44 270 top
C72  0.01uF, 16V  [0402-CAP]  76.89,42.44 270 top
C73  0.01uF, 16V  [0402-CAP]  78.16,42.44 270 top
C74  0.01uF, 16V  [0402-CAP]  79.43,42.44 270 top
C75  0.01uF, 16V  [0402-CAP]  71.91,51.97 270 top
C76  1uF, 10V  [0402-CAP]  43.18,33.78 270 bottom
C77  0.01uF, 16V  [0805]  35.84,25.37 270 top
C78  0.01uF, 16V  [0402-CAP]  22.73,41.78 270 top
C79  0.01uF, 16V  [0805]  41.78,33.78 90 bottom
C80  0.01uF, 16V  [0402-CAP]  19.02,8.46 270 top
C81  0.01uF, 16V  [0402-CAP]  20.29,8.46 270 top
C82  0.01uF, 16V  [0402-CAP]  21.56,8.46 270 top
C83  0.01uF, 16V  [0402-CAP]  22.83,8.46 270 top
C84  0.01uF, 16V  [0402-CAP]  24.1,8.46 270 top
C85  0.01uF, 16V  [0402-CAP]  25.37,8.46 270 top
C86  0.01uF, 16V  [0402-CAP]  79.91,37.08 90 top
C87  0.01uF, 16V  [0402-CAP]  81.18,37.08 90 top
C88  0.01uF, 16V  [0402-CAP]  78.64,37.08 90 top
C89  0.01uF, 16V  [0402-CAP]  77.37,37.08 90 top
C90  0.01uF, 16V  [0402-CAP]  76.1,37.08 90 top
C91  0.01uF, 16V  [0402-CAP]  74.83,37.08 90 top
C92  0.01uF, 16V  [0402-CAP]  73.56,37.08 90 top
C93  0.01uF, 16V  [0402-CAP]  72.29,37.08 90 top
C94  0.01uF, 16V  [0402-CAP]  71.02,37.08 90 top
C95  10uF, 10V  [0805]  69.49,37.08 90 top
C96  0.01uF, 16V  [0402-CAP]  68.07,31.88 270 top
C97  0.01uF, 16V  [0402-CAP]  69.34,31.88 270 top
C98  0.01uF, 16V  [0402-CAP]  70.61,31.88 270 top
C99  0.01uF, 16V  [0402-CAP]  71.88,31.88 270 top
C100  0.01uF, 16V  [0402-CAP]  73.15,31.88 270 top
C101  0.01uF, 16V  [0402-CAP]  74.42,31.88 270 top
C102  0.01uF, 16V  [0402-CAP]  75.69,31.88 270 top
C103  0.01uF, 16V  [0402-CAP]  76.96,31.88 270 top
C104  0.01uF, 16V  [0402-CAP]  78.23,31.88 270 top
C105  0.01uF, 16V  [0402-CAP]  79.5,31.88 270 top
C106  0.01uF, 16V  [0402-CAP]  37.87,31.98 180 bottom
C107  0.001uF, 50V  [0402-CAP]  37.87,33.22 180 bottom
C108  0.01uF, 16V  [0402-CAP]  37.85,34.54 180 bottom
C109  0.01uF, 16V  [0402-CAP]  78.13,26.59 270 top
C110  0.01uF, 16V  [0402-CAP]  79.4,26.59 270 top
C111  0.1uF, 16V  [0805]  9.32,23.42 180 bottom
C112  0.1uF, 16V  [0805]  15.27,25.07 0 top
C113  0.1uF, 16V  [0805]  9.22,20.29 270 top
C114  0.1uF, 16V  [0805]  9.3,23.44 270 top
C115  18pF, 50V  [0805]  31.24,60.2 270 top
C116  0.1uF, 16V  [0805]  9.17,20.32 0 bottom
C117  B45196H1107M309  [B45196H1107M309_PACKAGE]  21.08,83.31 90 top
C118  0.01uF, 16V  [0402-CAP]  24,72.9 270 top
C119  B45196H1107M309  [B45196H1107M309_PACKAGE]  20.45,63.12 90 top
C120  0.01uF, 16V  [0402-CAP]  23.37,52.7 270 top
C121  4.7uF, 50v  [0805]  41.83,21.84 180 top
FB1  LI0805H151R-10  [LI0805H151R-10_PACKAGE]  23.62,44.45 180 top
FB2  LI0805H151R-10  [LI0805H151R-10_PACKAGE]  40.01,33.78 90 bottom
FB3  LI0805H151R-10  [LI0805H151R-10_PACKAGE]  23.62,46.35 180 top
GND0  M01PTH  [1X01]  30.48,2.54 90 top
GND1  M01PTH  [1X01]  48.26,2.54 90 top
GND2  M01PTH  [1X01]  50.8,2.54 90 top
GND3  M01PTH  [1X01]  60.96,2.54 90 top
I2C2_SCL  M01PTH  [1X01]  3.43,10.67 0 top
I2C2_SDA  M01PTH  [1X01]  3.43,13.21 0 top
JP1  RS232  [1X03]  3.38,18.67 90 top
L1  VLCF5020T-2R2N2R6-3  [VLCF5020T-2R2N2R6-3]  62.31,13.79 180 top
L2  VLCF5020T-2R2N2R6-3  [VLCF5020T-2R2N2R6-3]  62.36,21.89 0 top
L3  ELL-5PR2R2N  [ELL-5PR2R2N]  53.9,25.86 270 top
LCD0  M01PTH  [1X01]  58.42,86.36 90 top
LCD1  M01PTH  [1X01]  55.88,86.36 90 top
LCD2  M01PTH  [1X01]  53.34,86.36 90 top
LCD3  M01PTH  [1X01]  50.8,86.36 90 top
LCD4  M01PTH  [1X01]  48.26,86.36 90 top
LCD5  M01PTH  [1X01]  45.72,86.36 90 top
LCD6  M01PTH  [1X01]  43.18,86.36 90 top
LCD7  M01PTH  [1X01]  40.64,86.36 90 top
LCD8  M01PTH  [1X01]  38.1,86.36 90 top
LCD9  M01PTH  [1X01]  35.56,86.36 90 top
LCD10  M01PTH  [1X01]  33.02,86.36 90 top
LCD11  M01PTH  [1X01]  30.48,86.36 90 top
LCD12  M01PTH  [1X01]  58.42,83.82 90 top
LCD13  M01PTH  [1X01]  55.88,83.82 90 top
LCD14  M01PTH  [1X01]  53.34,83.82 90 top
LCD15  M01PTH  [1X01]  50.8,83.82 90 top
LCD16  M01PTH  [1X01]  48.26,83.82 90 top
LCD17  M01PTH  [1X01]  45.72,83.82 90 top
LCD18  M01PTH  [1X01]  43.18,83.82 90 top
LCD19  M01PTH  [1X01]  40.64,83.82 90 top
LCD20  M01PTH  [1X01]  38.1,83.82 90 top
LCD21  M01PTH  [1X01]  35.56,83.82 90 top
LCD22  M01PTH  [1X01]  33.02,83.82 90 top
LCD23  M01PTH  [1X01]  30.48,83.82 90 top
LCD_AC_BIAS_EN  M01PTH  [1X01]  33.02,81.28 90 top
LCD_HSYNC  M01PTH  [1X01]  35.56,81.28 90 top
LCD_MEM_CLK  M01PTH  [1X01]  30.48,81.28 90 top
LCD_PCLK  M01PTH  [1X01]  40.64,81.28 90 top
LCD_VSYNC  M01PTH  [1X01]  38.1,81.28 90 top
LED1  LED_GREEN  [CHIP-LED0805]  48.36,7.72 180 top
P1  PJ-002A  [PJ-002A_PACKAGE]  81.28,6.73 180 top
R1  33  [0402-RES]  52.2,38.63 180 top
R2  33  [0402-RES]  52.2,37.49 180 top
R3  33  [0402-RES]  52.2,44.35 180 top
R4  33  [0402-RES]  52.2,45.49 180 top
R5  33  [0402-RES]  52.2,43.21 180 top
R6  33  [0402-RES]  52.2,34.06 180 top
R7  33  [0402-RES]  52.2,54.64 0 top
R8  33  [0402-RES]  52.2,55.78 0 top
R9  33  [0402-RES]  52.2,56.92 0 top
R10  33  [0402-RES]  52.2,58.06 0 top
R11  33  [0402-RES]  47.32,52.65 180 bottom
R12  33  [0402-RES]  47.32,53.8 180 bottom
R13  33  [0402-RES]  47.32,50.37 180 bottom
R14  33  [0402-RES]  52.2,52.35 0 top
R15  33  [0402-RES]  52.2,53.49 0 top
R16  33  [0402-RES]  52.2,47.78 180 top
R17  33  [0402-RES]  52.2,50.06 0 top
R18  33  [0402-RES]  52.2,51.21 0 top
R19  33  [0402-RES]  47.32,45.8 180 bottom
R20  33  [0402-RES]  47.32,46.94 180 bottom
R21  33  [0402-RES]  47.32,48.08 180 bottom
R22  33  [0402-RES]  47.32,49.23 180 bottom
R23  33  [0402-RES]  52.2,48.92 180 top
R24  33  [0402-RES]  52.2,59.21 0 top
R25  33  [0402-RES]  52.2,60.35 0 top
R26  33  [0402-RES]  47.32,51.51 180 bottom
R27  2.2K, 1%  [0402-RES]  67.79,46.08 180 top
R28  33  [0402-RES]  47.32,54.94 180 bottom
R29  33  [0402-RES]  47.32,43.48 0 bottom
R30  33  [0402-RES]  52.2,36.35 180 top
R31  33  [0402-RES]  52.2,39.78 180 top
R32  33  [0402-RES]  52.2,32.92 180 top
R33  0, 1%  [0402-RES]  37.03,28.68 270 top
R34  33  [0402-RES]  52.2,46.63 180 top
R35  33  [0402-RES]  47.32,42.34 0 bottom
R36  33  [0402-RES]  47.32,33.22 0 bottom
R37  33  [0402-RES]  52.2,35.2 180 top
R38  33  [0402-RES]  47.32,34.37 0 bottom
R39  33  [0402-RES]  47.32,32.11 0 bottom
R40  33  [0402-RES]  47.32,38.94 0 bottom
R41  33  [0402-RES]  47.32,36.65 0 bottom
R42  33  [0402-RES]  47.32,35.53 0 bottom
R43  33  [0402-RES]  47.32,37.8 0 bottom
R44  33  [0402-RES]  47.32,44.65 0 bottom
R45  33  [0402-RES]  47.32,56.08 180 bottom
R46  0, 0.1%  [0402-RES]  34.98,55.83 180 top
R47  33  [0402-RES]  52.2,42.06 180 top
R48  33  [0402-RES]  47.32,41.2 0 bottom
R49  33  [0402-RES]  47.32,40.06 0 bottom
R50  2.2K, 1%  [0402-RES]  67.79,48.51 180 top
R51  33  [0402-RES]  52.2,40.92 180 top
R52  1M, 1%  [0402-RES]  35,60.68 0 top
R53  10K, 1%  [0402-RES]  43.36,35.97 90 top
R54  1.5K, 5%  [0402-RES]  65.58,31.88 270 top
R55  0.1  [0805]  53.24,10.95 270 top
R56  1.5K, 5%  [0402-RES]  66.8,31.88 270 top
R57  0, 0.1%  [0402-RES]  41.96,18.41 180 top
R58  4.75K, 1%  [0402-RES]  35.76,28.7 270 top
R59  0, 1%  [0402-RES]  35.94,33.91 270 bottom
R60  100K, 1%  [0402-RES]  38.3,28.68 270 top
R61  0, 0.1%  [0402-RES]  13.82,8.48 90 top
R62  100K, 1%  [0402-RES]  42.11,28.68 90 top
R63  12.1K, 1%  [0402-RES]  60.93,18.47 0 top
R64  100K, 1%  [0402-RES]  30.86,33.91 90 bottom
R65  10K, 1%  [0402-RES]  41.71,14.61 180 top
R66  12.1K, 1%  [0402-RES]  38.91,14.61 0 top
R67  100K, 1%  [0402-RES]  34.01,15.9 180 top
R68  0, 0.1%  [0402-RES]  34.54,28.73 90 top
R69  0, 0.1%  [0402-RES]  46.41,28.65 90 top
R70  0, 0.1%  [0402-RES]  40.84,28.68 90 top
R71  0, 0.1%  [0402-RES]  43.38,28.68 90 top
R72  0, 0.1%  [0402-RES]  39.57,28.68 90 top
R73  0, 0.1%  [0402-RES]  41.96,20.07 180 top
R74  0, 0.1%  [0402-RES]  41.96,16.89 180 top
R75  470, 5%  [0402-RES]  48.39,11.07 90 top
R76  10K, 1%  [0402-RES]  6.6,37.47 90 bottom
R77  10K, 1%  [0402-RES]  4.06,37.47 90 bottom
R78  10K, 1%  [0402-RES]  4.06,41.66 270 bottom
R79  10K, 1%  [0402-RES]  5.33,41.66 270 bottom
R80  10K, 1%  [0402-RES]  6.6,41.66 270 bottom
R81  10K, 1%  [0402-RES]  5.33,37.47 90 bottom
R82  10K, 1%  [0402-RES]  7.87,37.47 270 bottom
R83  0, 1%  [0402-RES]  7.87,41.66 270 bottom
R84  100K, 1%  [0402-RES]  42.47,68.76 90 bottom
R85  100K, 1%  [0402-RES]  39.93,68.76 90 bottom
R86  100K, 1%  [0402-RES]  37.01,68.73 90 bottom
R87  100K, 1%  [0402-RES]  41.4,68.76 90 bottom
R88  100K, 1%  [0402-RES]  34.57,64.95 90 top
R89  100K, 1%  [0402-RES]  34.21,68.73 270 bottom
R90  100K, 1%  [0402-RES]  38.48,68.73 270 bottom
R91  100K, 1%  [0402-RES]  35.48,68.73 270 bottom
R92  100K, 1%  [0402-RES]  32.31,68.76 270 bottom
R93  100K, 1%  [0402-RES]  42.09,64.95 270 top
R94  100K, 1%  [0402-RES]  40.67,64.95 270 top
R95  100K, 1%  [0402-RES]  36.32,64.95 270 top
R96  100K, 1%  [0402-RES]  33.3,64.95 270 top
R97  100K, 1%  [0402-RES]  39.4,64.95 270 top
R98  100K, 1%  [0402-RES]  37.59,64.95 270 top
R99  100K, 1%  [0402-RES]  31.04,68.76 270 bottom
R100  0, 0.1%  [0402-RES]  42.16,35.97 90 top
R101  0, 0.1%  [0402-RES]  49.78,44.65 0 bottom
R102  4.75K, 1%  [0402-RES]  63.75,17.32 180 bottom
R103  10K, 1%  [0402-RES]  15.11,8.46 270 top
R104  WSC452750R00FEA  [WSC452750R00FEA_PACKAGE]  58.37,67.74 0 bottom
R105  10K, 1%  [0402-RES]  18.41,78.23 270 top
R106  0, 1%  [0402-RES]  20.32,50.39 180 top
R107  10K, 1%  [0402-RES]  18.29,72.9 270 top
R108  10K, 1%  [0402-RES]  17.27,58.04 270 top
R109  10K, 1%  [0402-RES]  17.4,52.7 270 top
R110  0, 1%  [0402-RES]  20.32,49.07 180 top
S1  B3U-1100P  [B3U-1100P_PACKAGE]  14.43,2.13 180 top
SYS_5V  M01PTH  [1X01]  58.42,2.54 90 top
U2  MT47H128M16RT-25E:C  [FBGA_84_BALL_RAM]  60.35,46.86 0 top
U3  CAT24C256WI-G  [SOIC8_CASE_751BD-01]  23.93,33.5 0 bottom
U4  TPS65217BRSLT  [RSL(S-PVQFN-N8)]  52.6,17.45 0 top
U5  NCP349MNAETBG  [DFN6]  68.76,6.71 180 top
U6  SN74LVC2G00DCUR  [DCU_8]  33.99,18.16 90 top
U7  SCHA5B0200  [SCHA5B0200_PACKAGE]  8.23,39.75 270 top
U8  ADM3202ARUZ  [ADM3202ARUZ_PACKAGE_TSSOP]  15.27,21.51 270 top
U9  USB_87520_0010BLF  [USB_87520_0010BLF_USB_HOST_PACKAGE]  7.04,74.3 270 top
U10  TPS2051BDGN  [DGN8]  21.18,75.46 180 top
U11  TPD4S012DRYR  [DRY6]  17.02,75.69 0 top
U12  TPS2051BDGN  [DGN8]  20.4,55.3 180 top
U13  TPD4S012DRYR  [DRY6]  16.51,55.37 0 top
U14  USB_87520_0010BLF  [USB_87520_0010BLF_USB_HOST_PACKAGE]  7.09,56.87 270 top
VDD_3V3A  M01PTH  [1X01]  53.34,2.54 90 top
VDD_3V3B  M01PTH  [1X01]  55.88,2.54 90 top
VDD_5V  M01PTH  [1X01]  63.5,2.54 90 top
Y1  MC-306_32.7680K-.A  [MC-306_PACKAGE]  33.63,33.96 0 top
Y2  CS325-24.000MABJ-UT  [CS325_PACKAGE]  35.05,58.19 0 top

## Tracks (layer width: path | path; a pad name or v marks a point on that pad's centre or on a via)
AGND
  Top 0.203: U4.41 48.22,18.05
  Top 0.305: 48.22,18.05 48.21,18.06
  Top 0.762: R57.1 42.64,18.44 43.66,18.44
  pour Top: 43.18,18.54 43.18,19.3 45.97,19.3 47.24,18.03 47.24,17.53 43.18,17.53
  pour Top: 47.09,18.26 48.16,18.26 48.31,18.11 48.31,17.83 48.26,17.78 47.24,17.53 46.99,17.78 46.89,17.78 46.89,18.06
AIN7  (via drill 0.2 pad 0.46)
  Top 0.127: v35.31,35.28 35.31,31.39 36.4,30.3 38.1,30.3 38.28,30.21 | 37.34,41.45 AM3359.C9
  Top 0.203: v36.96,41.1 37.34,41.45
  Top 0.406: R62.2 42.11,30.37 41.78,30.7 38.76,30.7 38.28,30.21 38.28,29.35 R60.1
  Bottom 0.127: v36.96,41.1 36.85,41.03 36.44,40.59 36.16,40.59 35.84,40.34 35.38,40.34 35.2,40.16 35.2,35.38 v35.31,35.28
BL_IN  (via drill 0.2 pad 0.46)
  Top 0.203: U4.37 49.33,19.65 49,19.98 49,21.31 v49.55,21.87
  Route3 0.203: v49.55,21.87 49.55,21.06 49.05,20.55 46.84,20.55 46.35,19.94 46.35,18.12 44.22,15.82 44.22,12.47 43.89,12.19 43.36,12.19 v43.08,11.96
  Route14 0.203: BL_IN.1 34.57,4.09 36.41,4.09 42.65,10.32 42.65,11.53 v43.08,11.96
BL_ISET1  (via drill 0.2 pad 0.46)
  Top 0.203: U4.35 50.81,19.87 v50.6,19.66
  Route3 0.203: v46.58,11.4 46.05,11.94 46.05,15.06 47.52,16.38 48.63,16.38 49.15,16.9 49.15,18.21 v50.6,19.66
  Route14 0.203: v46.58,11.4 45.03,11.4 44.42,10.79 44.42,10.19 43.89,9.65 43.89,7.59 40.64,4.34 BL_ISET1.1
BL_ISET2  (via drill 0.2 pad 0.46)
  Top 0.203: v50.32,21.95 50.39,21.87 50.39,20.45 U4.36
  Route3 0.203: v43.74,11.63 44.02,11.84 44.27,11.84 44.58,12.06 44.58,15.67 46.79,18.09 46.79,19.81 47.09,20.22 49.23,20.22 49.91,20.88 50.32,21.29 v50.32,21.95
  Route14 0.203: v43.74,11.63 43.74,11.1 44.07,10.77 44.07,10.36 43.74,10.03 43.43,9.89 38.1,4.56 BL_ISET2.1
BL_ISINK1  (via drill 0.2 pad 0.46)
  Top 0.203: v50.9,21.49 50.9,21.21 51.21,20.85 51.21,20.45 U4.34
  Route3 0.203: v44.96,10.41 45.29,11.02 45.29,15.37 47.47,17.55 47.47,17.92 50.9,21.35 v50.9,21.49
  Route14 0.203: v44.96,10.41 44.91,10.03 44.37,9.5 44.37,7.39 43.2,6.22 43.2,2.56 BL_ISINK1.1
BL_ISINK2  (via drill 0.2 pad 0.46)
  Top 0.203: v51.61,21.21 51.61,20.45 U4.33
  Route3 0.203: v45.76,10.45 45.64,10.64 45.64,15.21 47.35,16.76 48.41,16.76 48.74,17.09 48.74,18.58 50.91,20.75 51.09,20.75 51.55,21.21 v51.61,21.21
  Route14 0.203: v45.76,10.45 45.67,10.19 44.86,9.37 44.86,7.67 45.74,6.78 45.74,2.56 BL_ISINK2.1
BL_OUT  (via drill 0.2 pad 0.46)
  Top 0.203: U4.38 49.15,19.25 48.63,19.77 48.34,19.77 | v47.33,19.65 47.35,19.84 47.43,20.02
  Top 0.305: 48.34,19.77 48.09,20.02 47.43,20.02
  Top 0.406: 47.43,20.02 45.61,21.84 C121.1
  Route3 0.203: v43.43,10.49 44.93,11.91 44.93,15.52 47.12,17.7 47.12,19.07 47.33,19.29 v47.33,19.65 47.27,19.56
  Route14 0.203: BL_OUT.1 v43.43,10.49
BYPASS_PWRMNG
  Top 0.203: U4.47 49.19,15.65 49.03,15.49 48.68,15.49 48.4,15.21
  Top 0.305: 48.2,15.01 48.4,15.21
  Top 0.406: 48.2,15.01 46.01,12.83 C37.1
C1+
  Top 0.406: U8.1 11.68,24.34 C114.1
C1-
  Top 0.406: C114.2 9.35,22.49 U8.3
C2+
  Top 0.406: C113.1 9.43,21.4 10.39,21.4 10.83,21.84 U8.4
C2-
  Top 0.406: C113.2 9.23,19.38 10.22,19.38 10.53,19.84 10.53,20.55 11.32,21.19 U8.5
CAP_VBB_MPU  (via drill 0.2 pad 0.46)
  Top 0.305: v36.2,41.05 AM3359.C10
  Bottom 0.203: v36.2,41.05 36.09,41.05 35.71,40.66 35.26,40.66 34.84,40.27 34.82,34.62 C63.1
CAP_VDD_RTC  (via drill 0.2 pad 0.46)
  Top 0.127: 39.78,42.27 AM3359.D6 v40.16,41.91
  Route3 0.127: v40.16,41.91 40.16,39.9 40.31,39.75 40.31,39.14 v41.22,38.18
  Bottom 0.127: v41.22,38.18 43.36,36.09 43.36,34.44 43.18,34.44 C76.1
CAP_VDD_SRAM_CORE  (via drill 0.2 pad 0.46)
  Top 0.203: AM3359.D9 37.37,42.26 v37.74,41.88
  Bottom 0.203: C59.1 33.4,37.69 34.39,38.68 34.39,40.74 34.85,41.2 35.51,41.2 36.22,41.91 37.72,41.91 v37.74,41.88
CAP_VDD_SRAM_MPU  (via drill 0.2 pad 0.46)
  Top 0.203: AM3359.D11 35.76,42.24 v35.38,41.86
  Bottom 0.203: C62.1 32,37.52 33.68,39.19 33.68,41.33 34.21,41.86 v35.38,41.86
CD/EMU4  (via drill 0.2 pad 0.46)
  Top 0.203: AM3359.C15 v32.94,41.83
  Route3 0.203: v32.94,41.83 32.94,42.64 32.41,43.28 31.99,43.28 31.45,42.77 28.12,42.77 27.79,43.1 21.54,43.1 v21.03,42.6
  Bottom 0.203: v21.03,42.6 10.97,42.6 9.83,43.74 8.43,43.74 7.87,43.18 R83.1
CD_SD_CARD  (via drill 0.2 pad 0.46)
  Top 0.305: v7.9,39.75 7.9,41.53 8.76,42.39 10.13,42.39 11.18,43.43 12.63,43.43 U7.10
  Bottom 0.305: R83.2 7.87,39.78 v7.9,39.75
  Bottom 0.406: R82.1 R83.2
DC_IN
  Top 0.203: U4.10 54.01,13.29 54.15,13.16
  Top 0.305: U5.4 | U5.4 68.25,8.18 68.78,8.18 68.76,8.15 U5.5 | 68.24,7.67 U5.4 | 68.24,7.67 68.73,7.67 | C22.1 66.36,7.67 68.24,7.67
  pour Top: 68.83,8.23 67.84,8.23 67.82,8.2 67.82,7.52 67.56,7.52 66.93,6.99 65.66,6.99 65.28,7.37 58.42,7.37 55.75,10.03 55.75,11.43 54.08,13.21 54.03,13.61 54.74,12.95 55.5,12.95 56.52,11.94 57.4,11.94 59.05,10.29 67.56,10.29 68.83,9.02
DDR_A0  (via drill 0.2 pad 0.46)
  Top 0.127: 62.74,43.66 U2.M8 v62.36,44.02
  Route3 0.127: v62.36,44.02 62.36,43.69 61.12,42.46 60.54,42.46 60.35,42.39 59.97,42.16 58.62,42.16 v58.36,42.49
  Route14 0.127: v58.36,42.49 58.37,42.27 57.09,40.96 53.85,40.96 v53.57,41.27
  Bottom 0.127: 47.98,41.2 R48.1 48.69,41.2 48.77,41.27 48.77,41.53 48.9,41.66 49.15,41.66 49.28,41.53 49.28,40.77 49.4,40.64 49.66,40.64 49.78,40.77 49.78,41.53 49.91,41.66 50.16,41.66 50.29,41.53 50.29,40.77 50.42,40.64 50.67,40.64 50.8,40.77 50.8,41.53 50.93,41.66 51.18,41.66 51.31,41.53 51.31,40.77 51.44,40.64 51.69,40.64 51.82,40.77 51.82,41.53 51.94,41.66 52.2,41.66 52.32,41.53 52.32,41.4 52.45,41.27 v53.57,41.27
DDR_A0_PROC  (via drill 0.2 pad 0.46)
  Top 0.127: AM3359.F3 42.16,43.84 v42.57,43.46
  Bottom 0.127: v42.57,43.46 44.4,43.46 45.87,41.99 45.87,41.48 46.15,41.2 R48.2
DDR_A1  (via drill 0.2 pad 0.46)
  Top 0.127: v53.57,45.41 52.86,45.41 R4.1 | U2.M3 v58.4,44.04
  Route3 0.127: v53.57,45.41 54.3,45.41 54.43,45.57 55.03,45.57 55.19,45.4 55.19,44.2 55.27,44.12 55.42,44.12 55.5,44.2 55.5,45.34 55.58,45.41 55.8,45.41 55.88,45.34 55.88,44.2 55.96,44.12 56.19,44.12 56.26,44.2 56.26,45.34 56.34,45.41 56.57,45.41 56.64,45.34 56.64,44.2 56.72,44.12 56.95,44.12 57.02,44.2 57.02,45.09 57.15,45.21 57.4,45.21 57.53,45.09 57.53,44.72 57.61,44.64 57.84,44.64 57.91,44.72 57.91,45.21 57.99,45.29 58.22,45.29 58.29,45.21 58.29,44.7 58.37,44.63 58.6,44.63 58.67,44.7 58.67,45.21 58.75,45.29 58.98,45.29 59.05,45.21 59.05,44.58 58.52,44.04 v58.4,44.04
DDR_A1_PROC
  Top 0.127: 51.51,45.46 R4.2 51.52,45.47 50.16,45.47 50.04,45.34 50.04,45.06 49.91,44.93 49.66,44.93 49.53,45.06 49.53,45.34 49.4,45.47 49.15,45.47 49.02,45.34 49.02,45.06 48.9,44.93 48.64,44.93 48.51,45.06 48.51,45.34 48.39,45.47 48.13,45.47 48.01,45.34 48.01,45.06 47.88,44.93 47.62,44.93 47.5,45.06 47.5,45.34 47.37,45.47 47.12,45.47 46.99,45.34 46.99,45.06 46.86,44.93 46.61,44.93 46.48,45.06 46.48,45.34 46.35,45.47 46.1,45.47 45.97,45.34 45.97,45.06 45.85,44.93 45.59,44.93 45.47,45.06 45.47,45.34 45.34,45.47 45.09,45.47 44.96,45.34 44.96,45.06 44.83,44.93 44.58,44.93 44.45,45.06 44.45,45.34 44.33,45.46 AM3359.H1
DDR_A2  (via drill 0.2 pad 0.46)
  Top 0.127: v61.02,43.43 61.29,43.66 U2.M7
  Route14 0.127: v50.6,38.53 50.8,38.73 50.8,41.53 50.93,41.66 51.18,41.66 51.31,41.53 51.31,40.77 51.44,40.64 51.69,40.64 51.82,40.77 51.82,41.53 51.94,41.66 52.2,41.66 52.32,41.53 52.32,41.17 52.78,40.69 57.28,40.69 59.07,42.49 59.26,42.49 59.69,42.93 59.69,43.42 59.91,43.64 60.26,43.64 60.47,43.43 v61.02,43.43
  Bottom 0.127: v50.6,38.53 49.78,37.72 47.98,37.72 47.98,37.8 R43.1
DDR_A2_PROC  (via drill 0.2 pad 0.46)
  Top 0.127: AM3359.E4 41.37,43.06 v41.76,42.67
  Bottom 0.127: v41.76,42.67 42.2,42.2 44.16,42.2 44.76,41.63 44.76,41.15 45.36,40.54 45.36,38.51 46.1,37.77 46.65,37.77 R43.2
DDR_A3  (via drill 0.2 pad 0.46)
  Top 0.127: 59.18,43.13 59.21,43.16 v59.14,43.28 58.36,43.28 U2.N2 57.96,42.85
  Bottom 0.127: 47.98,34.37 R38.1 48.72,34.37 53.98,39.65 53.99,40.69 55.92,42.67 56.13,42.67 56.26,42.55 56.26,42.16 56.39,42.04 56.52,42.04 56.64,42.16 56.64,42.67 56.77,42.8 56.9,42.8 57.02,42.67 57.02,42.16 57.52,41.66 58.55,41.66 59.18,42.29 59.18,43.23 v59.14,43.28
DDR_A3_PROC  (via drill 0.2 pad 0.46)
  Top 0.127: AM3359.C3 v42.57,41.03
  Bottom 0.127: v42.57,41.03 43.16,41.03 44.3,39.9 44.3,36.68 45.8,35.18 45.8,34.62 46.05,34.37 R38.2
DDR_A4  (via drill 0.2 pad 0.46)
  Top 0.127: R37.1 v53.91,35.2 | v63.22,42.47 U2.N8
  Route3 0.127: v53.91,35.2 54.86,36.12 54.86,37.69 54.99,37.82 55.37,37.82 55.5,37.69 55.5,37.47 55.63,37.34 56.01,37.34 56.13,37.47 56.13,37.85 56.26,37.97 56.64,37.97 56.77,37.85 56.77,37.47 56.9,37.34 57.28,37.34 57.4,37.47 57.4,38.53 59.74,40.87 61.21,40.87 61.7,41.35 61.7,41.77 62.38,42.46 63.21,42.46 v63.22,42.47
DDR_A4_PROC
  Top 0.127: AM3359.C2 42.97,41.46 43.36,41.07 47.69,41.07 49.2,39.53 49.2,36.04 50.04,35.2 R37.2 51.47,35.28
DDR_A5
  Top 0.127: U2.N3 58.78,42.85 59.54,42.85 59.74,42.65 59.74,41.68 59.98,41.4 60.49,41.4 61.09,40.89 61.09,40.18 60.96,40.06 60.71,40.06 60.58,40.18 60.58,40.89 60.45,41.02 59.87,41.02 55.12,36.22 55.12,34.42 54.74,34.04 52.87,34.04 R6.1
DDR_A5_PROC
  Top 0.127: AM3359.B1 47.44,40.66 48.79,39.31 48.79,35.92 50.65,34.06 R6.2 51.52,34.09
DDR_A6  (via drill 0.2 pad 0.46)
  Top 0.127: v60.19,42.86 U2.N7
  Route14 0.127: v60.19,42.86 60.02,42.85 59.38,42.22 59.18,42.22 57.42,40.44 57.2,40.44 56.77,40.01 56.26,40.01 56.13,40.13 55.88,40.13 55.75,40.01 55.75,39.88 55.63,39.75 55.37,39.75 55.24,39.88 55.24,40.01 55.12,40.13 54.86,40.13 54.74,40.01 54.74,39.88 54.61,39.75 54.36,39.75 54.23,39.88 54.23,40.26 54.1,40.39 52.91,40.39 52.31,39.79 52.31,39.46 50.77,37.92 50.19,37.92 49.63,37.26 v49.63,36.55
  Bottom 0.127: v49.63,36.55 49.2,36.55 48.56,35.92 47.98,35.92 47.98,35.53 R42.1
DDR_A6_PROC  (via drill 0.2 pad 0.46)
  Top 0.127: AM3359.D5 40.56,42.24 v40.95,41.86
  Bottom 0.127: v40.95,41.86 41.35,41.45 43.56,41.45 43.99,41.02 43.99,40.77 44.65,40.11 44.65,36.93 46.08,35.51 46.65,35.51 R42.2
DDR_A7
  Top 0.127: U2.P2 57.94,42.06 | R31.1 52.98,39.9 53.29,40.28 53.7,40.28 53.95,40.49 53.95,40.63 54.05,40.73 54.2,40.73 54.25,40.66 54.25,40.08 54.33,40.01 54.48,40.01 54.56,40.08 54.56,40.66 54.63,40.74 54.79,40.74 54.86,40.66 54.86,40.11 54.94,40.03 55.09,40.03 55.17,40.11 55.17,40.66 55.24,40.74 55.4,40.74 55.47,40.66 55.47,40.11 55.55,40.03 55.7,40.03 55.78,40.11 55.78,40.66 55.85,40.74 56.01,40.74 56.08,40.66 56.08,40.08 56.16,40.01 56.31,40.01 56.39,40.08 56.39,40.66 56.46,40.74 56.59,40.74 56.67,40.66 56.67,40.46 56.74,40.39 56.84,40.39 56.92,40.46 56.92,40.89 56.82,41 54.86,41 54.66,41.2 54.66,41.39 55.42,42.16 57.01,42.16 57.11,42.06 U2.P2 | U2.P2 57.93,42.04 57.91,42.06
DDR_A7_PROC
  Top 0.127: AM3359.E2 42.97,43.06 43.36,42.67 49.15,42.67 49.35,42.47 49.35,41.91 49.51,41.76 50.11,41.76 50.29,41.58 50.29,40.97 50.49,40.77 50.83,40.77 50.93,40.66 50.93,40.4 R31.2
DDR_A8  (via drill 0.2 pad 0.46)
  Top 0.127: 62.76,42.06 U2.P8 v63.12,41.68
  Route14 0.127: v63.12,41.68 63.12,41.13 61.76,39.78 58.37,39.78 57.66,39.29 52.78,39.29 50.86,37.38 v50.38,37.38
  Bottom 0.127: v50.38,37.38 48.95,37.44 48.56,37.06 47.98,37.06 47.98,36.65 R41.1
DDR_A8_PROC  (via drill 0.2 pad 0.46)
  Top 0.127: AM3359.D4 v41.74,41.88
  Bottom 0.127: v41.74,41.88 43.97,41.88 44.37,41.45 44.37,40.95 45.01,40.31 45.01,37.62 45.97,36.65 R41.2
DDR_A9
  Top 0.127: U2.P3 58.78,42.06 59.13,42.06 59.44,41.76 59.44,41 55.19,36.75 55.04,36.75 54.74,36.45 54.74,34.54 54.65,34.42 54.45,34.42 54.36,34.54 54.36,36.58 54.27,36.7 54.06,36.7 53.98,36.59 53.98,35.81 53.87,35.69 53.7,35.69 53.59,35.81 53.59,36.58 53.47,36.7 53.21,36.7 R30.1
DDR_A9_PROC
  Top 0.127: AM3359.C1 47.98,41.46 49.73,39.7 49.73,37.29 50.06,36.96 50.06,35.74 50.14,35.66 50.27,35.66 50.34,35.74 50.34,36.83 50.42,36.91 50.57,36.91 50.65,36.83 50.65,36.45 50.75,36.35 R30.2 51.45,36.45
DDR_A10  (via drill 0.2 pad 0.46)
  Top 0.127: v55.99,43.13 56.52,43.66 57.94,43.66 U2.M2
  Bottom 0.127: R49.1 47.95,40.06 47.98,40.08 48.01,40.06 48.64,40.06 48.72,40.13 48.72,40.28 48.82,40.39 48.97,40.39 49.07,40.28 49.07,39.6 49.15,39.52 49.3,39.52 49.38,39.6 49.38,40.18 49.48,40.28 49.63,40.28 49.73,40.18 49.73,39.62 49.84,39.52 49.99,39.52 50.09,39.62 50.09,40.18 50.19,40.28 50.34,40.28 50.44,40.18 50.44,39.37 50.55,39.27 50.7,39.27 50.8,39.37 50.8,40.18 50.9,40.28 51.05,40.28 51.16,40.18 51.16,39.37 51.26,39.27 51.41,39.27 51.51,39.37 51.51,40.18 51.61,40.28 51.77,40.28 51.87,40.18 51.87,39.37 51.97,39.27 52.12,39.27 52.22,39.37 52.22,40.89 52.32,41 52.53,41 52.63,40.89 52.63,39.62 52.73,39.52 52.83,39.52 52.93,39.62 52.95,39.99 v55.99,43.13
DDR_A10_PROC  (via drill 0.2 pad 0.46)
  Top 0.127: AM3359.F4 v41.76,43.46
  Bottom 0.127: v41.76,43.46 42.16,43.04 44.27,43.04 45.47,41.86 45.47,41.33 45.95,40.84 45.95,40.21 46.1,40.06 R49.2
DDR_A11  (via drill 0.2 pad 0.46)
  Top 0.127: 52.9,42.01 52.86,42.09 52.83,42.06 R47.1 52.97,41.94 v54.12,41.94 | U2.P7 60.67,42.06 v60.52,41.91
  Route3 0.127: v60.52,41.91 58.52,41.88 57.4,40.79 56.08,40.79 55.98,40.69 55.98,38.71 55.83,38.56 55.58,38.56 55.42,38.71 55.42,40.69 55.32,40.79 55.02,40.79 54.91,40.69 54.91,38.71 54.76,38.56 54.51,38.56 54.34,38.7 54.34,41.71 v54.12,41.94
DDR_A11_PROC
  Top 0.127: AM3359.F2 42.96,43.83 43.33,43.46 49.55,43.46 50.95,42.06 R47.2 51.5,42.01
DDR_A12  (via drill 0.2 pad 0.46)
  Top 0.127: 57.94,41.25 U2.R2 57.17,40.48 57.17,40.21 56.31,39.34 56.08,39.34 56.01,39.42 56.01,39.62 55.88,39.75 55.63,39.75 55.5,39.62 55.5,39.24 55.37,39.12 55.12,39.12 54.99,39.24 54.99,39.62 54.86,39.75 54.61,39.75 54.48,39.62 54.48,39.24 54.36,39.12 54.1,39.12 53.98,39.24 53.98,39.62 53.85,39.75 53.7,39.75 v53.56,39.87
  Bottom 0.127: R40.1 48.54,38.94 48.62,38.86 48.62,38.2 48.72,38.1 48.87,38.1 48.97,38.2 48.97,39.12 49.05,39.22 49.2,39.22 49.28,39.12 49.28,38.18 49.38,38.1 49.48,38.1 49.58,38.18 49.58,39.12 49.68,39.22 49.89,39.22 50.14,38.96 50.85,38.96 51.05,38.76 51.05,37.57 51.13,37.49 51.28,37.49 51.36,37.57 51.36,38.81 51.44,38.91 51.59,38.91 51.66,38.81 51.66,38.08 51.74,38 51.84,38 51.92,38.08 51.92,38.84 51.99,38.91 52.15,38.91 52.22,38.81 52.22,38.61 52.32,38.53 52.43,38.53 52.53,38.61 52.53,38.79 v53.56,39.87
DDR_A12_PROC  (via drill 0.2 pad 0.46)
  Top 0.127: AM3359.E3 42.16,43.03 v42.55,42.62
  Bottom 0.127: v42.55,42.62 44.23,42.62 45.11,41.76 45.11,41.22 45.64,40.69 45.64,39.78 45.9,39.52 45.9,39.19 46.15,38.94 R40.2
DDR_A13
  Bottom 0.406: R44.1 R101.2
DDR_A13_MEM  (via drill 0.2 pad 0.46)
  Top 0.127: 62.74,41.25 U2.R8 v62.36,41.66
  Route14 0.127: v54.13,43.94 55.47,43.94 55.96,44.42 56.64,44.42 57.15,44.93 60.17,44.93 60.68,44.42 60.68,44.16 60.9,43.94 61.48,43.94 62.36,43.07 v62.36,41.66
  Bottom 0.127: R101.1 50.98,44.65 51.13,44.81 51.13,45.7 51.21,45.77 51.44,45.77 51.51,45.7 51.51,44.27 51.59,44.2 51.82,44.2 51.89,44.27 51.89,45.7 51.97,45.77 52.2,45.77 52.27,45.7 52.27,44.27 52.35,44.2 52.58,44.2 52.65,44.27 52.65,45.7 52.73,45.77 52.96,45.77 53.03,45.7 53.03,44.27 53.11,44.2 53.8,44.2 v54.13,43.94
DDR_A13_PROC  (via drill 0.2 pad 0.46)
  Top 0.127: AM3359.H3 42.16,45.45 v42.55,45.06
  Bottom 0.127: v42.55,45.06 45.29,45.06 45.7,44.65 R44.2
DDR_BA0  (via drill 0.2 pad 0.46)
  Top 0.127: U2.L2 57.94,44.45 v57.56,44.12
  Route14 0.127: v57.56,44.12 57.56,43.27 56.11,41.82 v56.11,41.5
  Bottom 0.127: R39.1 47.98,32.11 47.98,32.49 48.56,32.49 48.87,32.79 48.87,33.71 54.53,39.37 54.53,40.46 55.07,41 55.61,40.98 v56.11,41.5
DDR_BA0_PROC  (via drill 0.2 pad 0.46)
  Top 0.127: AM3359.C4 41.37,41.46 v41.76,41.02
  Bottom 0.127: v41.76,41.02 42.14,40.69 42.14,39.98 42.65,39.47 42.65,37.21 43.64,36.22 43.64,35.36 44.86,34.14 44.86,32.99 45.74,32.11 R39.2
DDR_BA1  (via drill 0.2 pad 0.46)
  Top 0.127: 58.78,44.45 U2.L3 59.96,43.37 60.3,43.37 60.4,43.45 60.4,44.78 60.3,44.88 59.99,44.88 59.85,44.73 v59.85,44.23 | R51.1 52.98,40.64 53.58,40.64 55.22,42.33 55.38,42.49 v57.57,42.49
  Route3 0.127: v57.57,42.49 57.66,42.6 58,43 58.61,43 58.85,42.77 58.85,42.53 58.91,42.47 59.02,42.47 59.08,42.55 59.08,42.72 59.13,42.77 59.31,42.77 59.36,42.72 59.36,42.55 59.44,42.47 59.61,42.47 59.69,42.55 59.69,43.64 59.77,43.71 59.89,43.71 59.97,43.64 59.97,43.56 60.05,43.47 60.17,43.47 60.25,43.55 60.25,43.94 60.3,44.01 60.44,44.01 60.49,43.93 60.49,43.29 60.83,42.9 61.2,42.9 61.7,43.42 61.7,43.75 61.48,43.94 60.95,43.94 60.63,44.25 59.84,44.25 v59.85,44.23
DDR_BA1_PROC
  Top 0.127: AM3359.E1 49.22,43.06 51.36,40.92 R51.2
DDR_BA2  (via drill 0.2 pad 0.46)
  Top 0.127: v55.22,43.2 56.46,44.45 U2.L1
  Route14 0.127: v55.36,41.48 55.36,43.07 v55.22,43.2
  Bottom 0.127: v55.36,41.48 55.07,41.4 54.25,40.58 54.25,39.5 48.59,33.83 48.59,33.3 48.51,33.22 R36.1 47.98,33.22
DDR_BA2_PROC  (via drill 0.2 pad 0.46)
  Top 0.127: AM3359.B3 42.16,40.64 v42.57,40.23
  Bottom 0.127: R36.2 45.95,33.22 45.39,33.78 45.39,35.05 43.69,36.75 43.69,38.68 43.59,38.79 43.38,38.79 43.28,38.68 43.28,37.34 43.2,37.26 43.03,37.26 42.93,37.36 42.93,40.13 42.82,40.23 v42.57,40.23
DDR_CASN  (via drill 0.2 pad 0.46)
  Top 0.127: v61.27,44.45 U2.L7 | R5.1 53.15,42.9 v54.36,42.9
  Route3 0.127: v61.27,44.45 60.91,44.74 59.47,44.74 59.31,44.58 59.31,44.02 59.12,43.83 58.95,43.83 58.61,43.48 57.85,43.48 56.77,42.44 53.77,42.44 53.4,42.01 50.19,42.01 50.01,42.14 50.01,42.77 50.16,42.9 52.18,42.9 52.34,42.75 54.2,42.75 v54.36,42.9
DDR_CASN_PROC
  Top 0.127: AM3359.F1 49.93,43.85 50.58,43.2 R5.2 51.4,43.36
DDR_CKE  (via drill 0.2 pad 0.46)
  Top 0.127: v54.7,45.06 54.97,45.26 57.94,45.26 U2.K2
  Route14 0.127: v50.67,43.74 51.36,43.74 51.44,43.81 51.44,46.56 51.51,46.63 51.74,46.63 51.82,46.56 51.82,43.81 51.89,43.74 52.12,43.74 52.2,43.81 52.2,46.46 52.38,46.63 53.12,46.63 v54.7,45.06
  Bottom 0.127: R29.1 48.59,43.48 48.69,43.59 48.69,43.81 48.77,43.89 48.92,43.89 49,43.81 49,42.75 49.07,42.67 49.23,42.67 49.3,42.75 49.3,43.81 49.38,43.89 49.53,43.89 49.61,43.81 49.61,42.75 49.68,42.67 49.84,42.67 49.91,42.75 49.91,43.81 49.99,43.89 50.47,43.89 v50.67,43.74
DDR_CKE_PROC  (via drill 0.2 pad 0.46)
  Top 0.127: AM3359.G3 42.16,44.63 v42.56,44.31
  Bottom 0.127: v42.56,44.31 45.05,44.31 45.87,43.48 R29.2
DDR_CLK  (via drill 0.2 pad 0.46)
  Top 0.127: v57.89,40.11 57.89,39.93 54.99,37.03 53.49,37.03 53.44,37.08 52.86,37.08 R2.1 | v63.12,46.48 U2.J8
  Route3 0.127: v57.89,40.11 57.89,40.89 58.31,41.31 59.31,41.31 59.4,41.4 60.83,41.4 61.1,41.67 61.1,41.94 62.32,43.16 62.32,43.24 v63.12,44.04
  Bottom 0.127: v63.12,44.04 v63.12,46.48
DDR_CLK_PROC
  Top 0.127: AM3359.D2 42.99,42.26 43.36,41.86 48.25,41.86 50.16,39.94 50.16,38.33 51,37.49 R2.2 51.37,37.67
DDR_CLKN  (via drill 0.2 pad 0.46)
  Top 0.127: U2.K8 62.76,45.26 63.3,44.73 v63.55,44.72 | R1.1 53.49,38.63 53.65,38.79 53.87,38.79 53.95,38.71 53.95,37.72 54.03,37.64 54.18,37.64 54.25,37.72 54.25,38.71 54.33,38.79 54.48,38.79 54.56,38.71 54.56,37.72 54.63,37.64 54.79,37.64 54.86,37.72 54.86,38.71 54.94,38.79 55.09,38.79 55.17,38.71 55.17,38.02 55.24,37.95 55.35,37.95 57.45,40.06 57.45,40.3 57.78,40.63 58.45,40.63 v58.46,40.64
  Route3 0.127: 63.54,44.72 v63.55,44.72 63.65,44.62 63.65,43.81 63.31,43.48 62.67,42.85 62.38,42.85 61.38,41.83 61.38,41.5 61.02,41.15 59.59,41.15 59.11,40.64 v58.46,40.64
DDR_CLKN_PROC
  Top 0.127: AM3359.D1 48.6,42.26 50.52,40.34 50.52,39.17 51.13,38.68 R1.2
DDR_CSN  (via drill 0.2 pad 0.46)
  Top 0.127: 62.74,44.45 U2.L8 v62.36,44.81 | R34.1 52.86,46.23 53.44,46.23 54.1,45.57 54.25,45.57 54.33,45.64 54.33,46.02 54.41,46.1 54.63,46.1 54.71,46.02 54.71,45.64 54.79,45.57 55.02,45.57 55.09,45.64 55.09,46.02 55.17,46.1 55.4,46.1 55.47,46.02 55.47,45.64 55.55,45.57 55.78,45.57 55.85,45.64 55.85,46.02 55.93,46.1 56.16,46.1 56.24,46.02 56.24,45.64 56.31,45.57 57.43,45.57 v57.58,45.7
  Route3 0.127: v57.58,45.7 57.56,45.64 59.13,45.64 59.36,45.41 59.36,45.11 59.44,45.03 59.66,45.03 59.74,45.11 59.74,45.57 59.82,45.64 60.05,45.64 60.12,45.57 60.12,45.11 60.2,45.03 60.43,45.03 60.5,45.11 60.5,45.57 60.58,45.64 60.81,45.64 60.88,45.57 60.88,45.11 60.96,45.03 61.19,45.03 61.27,45.11 61.27,45.57 61.34,45.64 63.5,45.64 63.59,45.58 63.59,45.4 63.5,45.34 61.8,45.34 61.72,45.26 61.72,44.88 61.8,44.81 v62.36,44.81
DDR_CSN_PROC
  Top 0.127: AM3359.H2 43.36,45.85 50.22,45.85 50.95,46.56 51.47,46.56 R34.2
DDR_D0  (via drill 0.2 pad 0.46)
  Top 0.127: U2.G8 62.74,47.65 v62.33,47.3
  Route14 0.127: v49.3,51.13 49.3,51.18 51.13,53.01 51.13,53.67 51.23,53.77 51.46,53.77 51.56,53.67 51.56,53.09 51.64,53.01 51.84,53.01 51.92,53.09 51.92,53.67 51.99,53.75 52.25,53.75 52.32,53.67 52.32,53.09 52.4,53.01 52.65,53.01 52.73,53.09 52.73,53.67 52.83,53.77 53.06,53.77 53.16,53.67 53.16,53.39 53.65,52.91 55.8,52.91 56.49,53.59 58.06,53.59 61.89,49.76 61.89,47.75 v62.33,47.3
  Bottom 0.127: R13.2 48.54,50.37 v49.3,51.13
DDR_D0_PROC  (via drill 0.2 pad 0.46)
  Top 0.127: AM3359.M3 v42.56,49.05
  Bottom 0.127: v42.56,49.05 45.31,49.05 45.87,49.61 45.87,50.06 46.02,50.22 46.52,50.22 R13.1
DDR_D1  (via drill 0.2 pad 0.46)
  Top 0.127: 57.94,47.65 U2.G2 v57.56,48.01